# Altium project ASM001-design.PrjPcb (part 1 of 2)
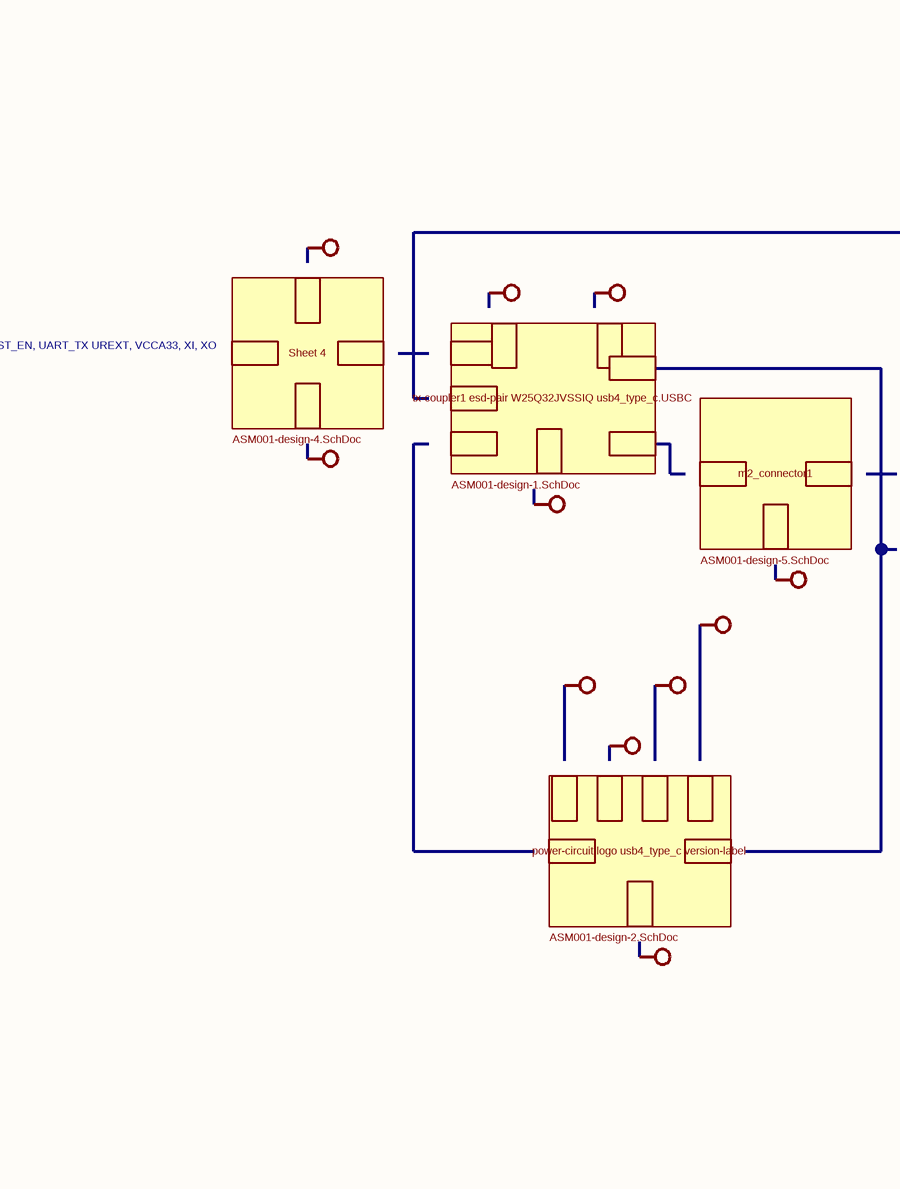
[diagram p0: jitx-top.SchDoc, centre column 2 of 4]
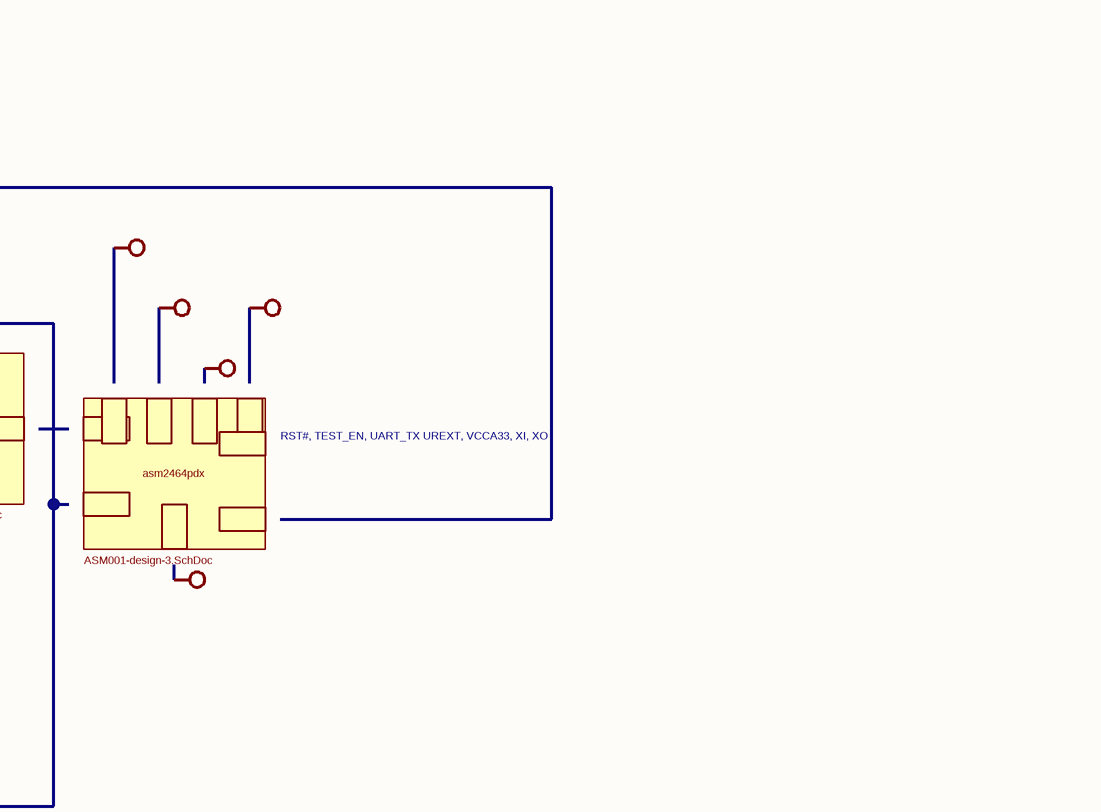
[diagram p1: jitx-top.SchDoc, centre column 3 of 4]
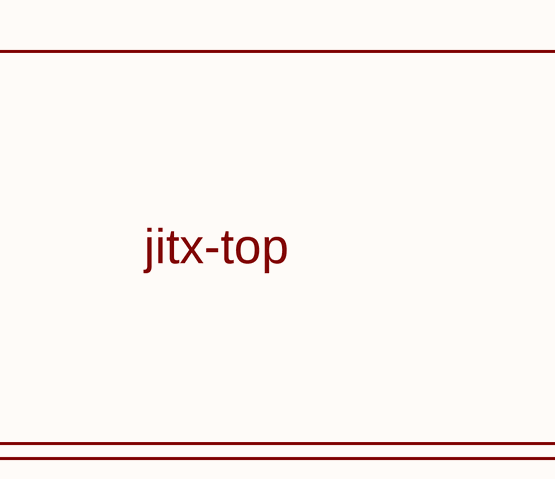
[diagram p2: jitx-top.SchDoc, bottom column 4 of 4]
JITx_Version: 1.0.52.0; JITx_User: John Simons; JITx_Machine: JOHN-WIN11; JITx_Date: 2/7/2025 9:14 PM
6 sheets, 65 parts. Net scope: flat (ports and power ports of the same name join across sheets).
Board file: ASM001-design.PcbDoc
Sheets:
  jitx-top.SchDoc
    tx-coupler1
esd-pair
W25Q32JVSSIQ
usb4_type_c.USBC = ASM001-design-1.SchDoc
    power-circuit
logo
usb4_type_c
version-label = ASM001-design-2.SchDoc
    asm2464pdx = ASM001-design-3.SchDoc
    Sheet 4 = ASM001-design-4.SchDoc
    m2_connector1 = ASM001-design-5.SchDoc

## Sheet jitx-top.SchDoc
size 558 x 431 mm

### Sub-sheets
asm2464pdx = ASM001-design-3.SchDoc: , , , , , , , , 
m2_connector1 = ASM001-design-5.SchDoc: , , 
power-circuit
logo
usb4_type_c
version-label = ASM001-design-2.SchDoc: , , , , , , 
Sheet 4 = ASM001-design-4.SchDoc: , , , 
tx-coupler1
esd-pair
W25Q32JVSSIQ
usb4_type_c.USBC = ASM001-design-1.SchDoc: , , , , , , , 

### Notes on the sheet
- jitx-top
- Labels drawn without touching a wire or pin: RST#, TEST_EN, UART_TX
UREXT, VCCA33, XI, XO

## Sheet ASM001-design-1.SchDoc
size 558 x 431 mm
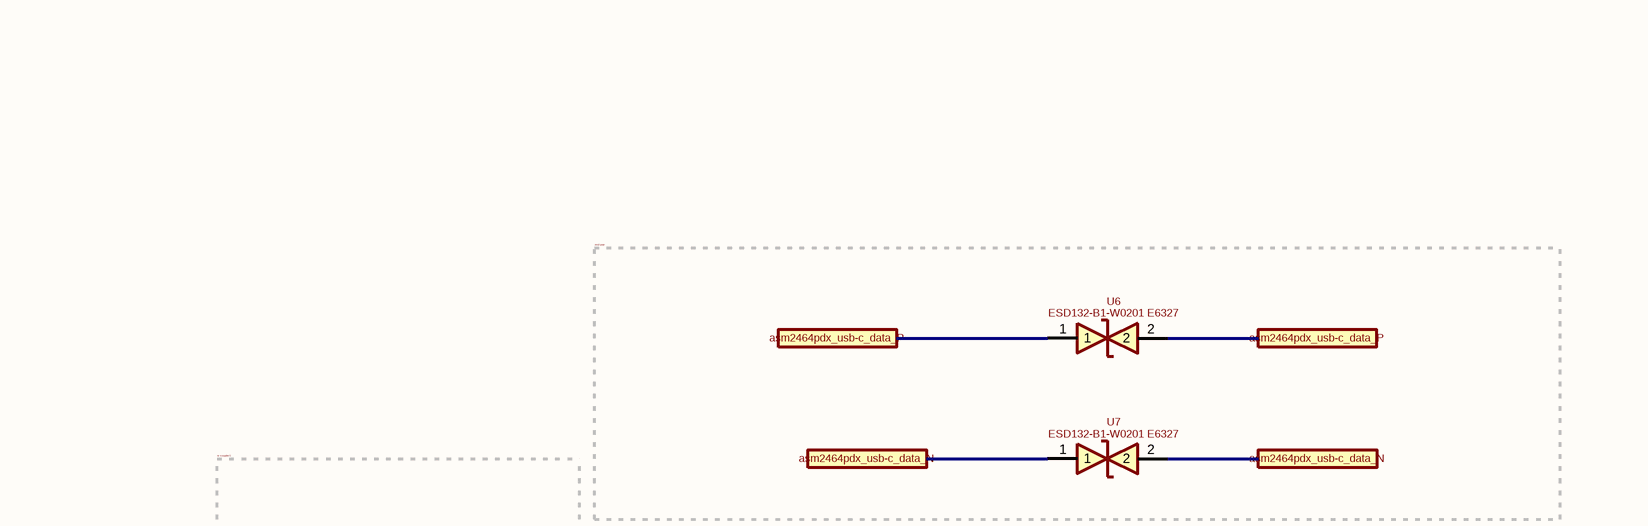
[diagram p3: ASM001-design-1.SchDoc, top column 2 of 4]
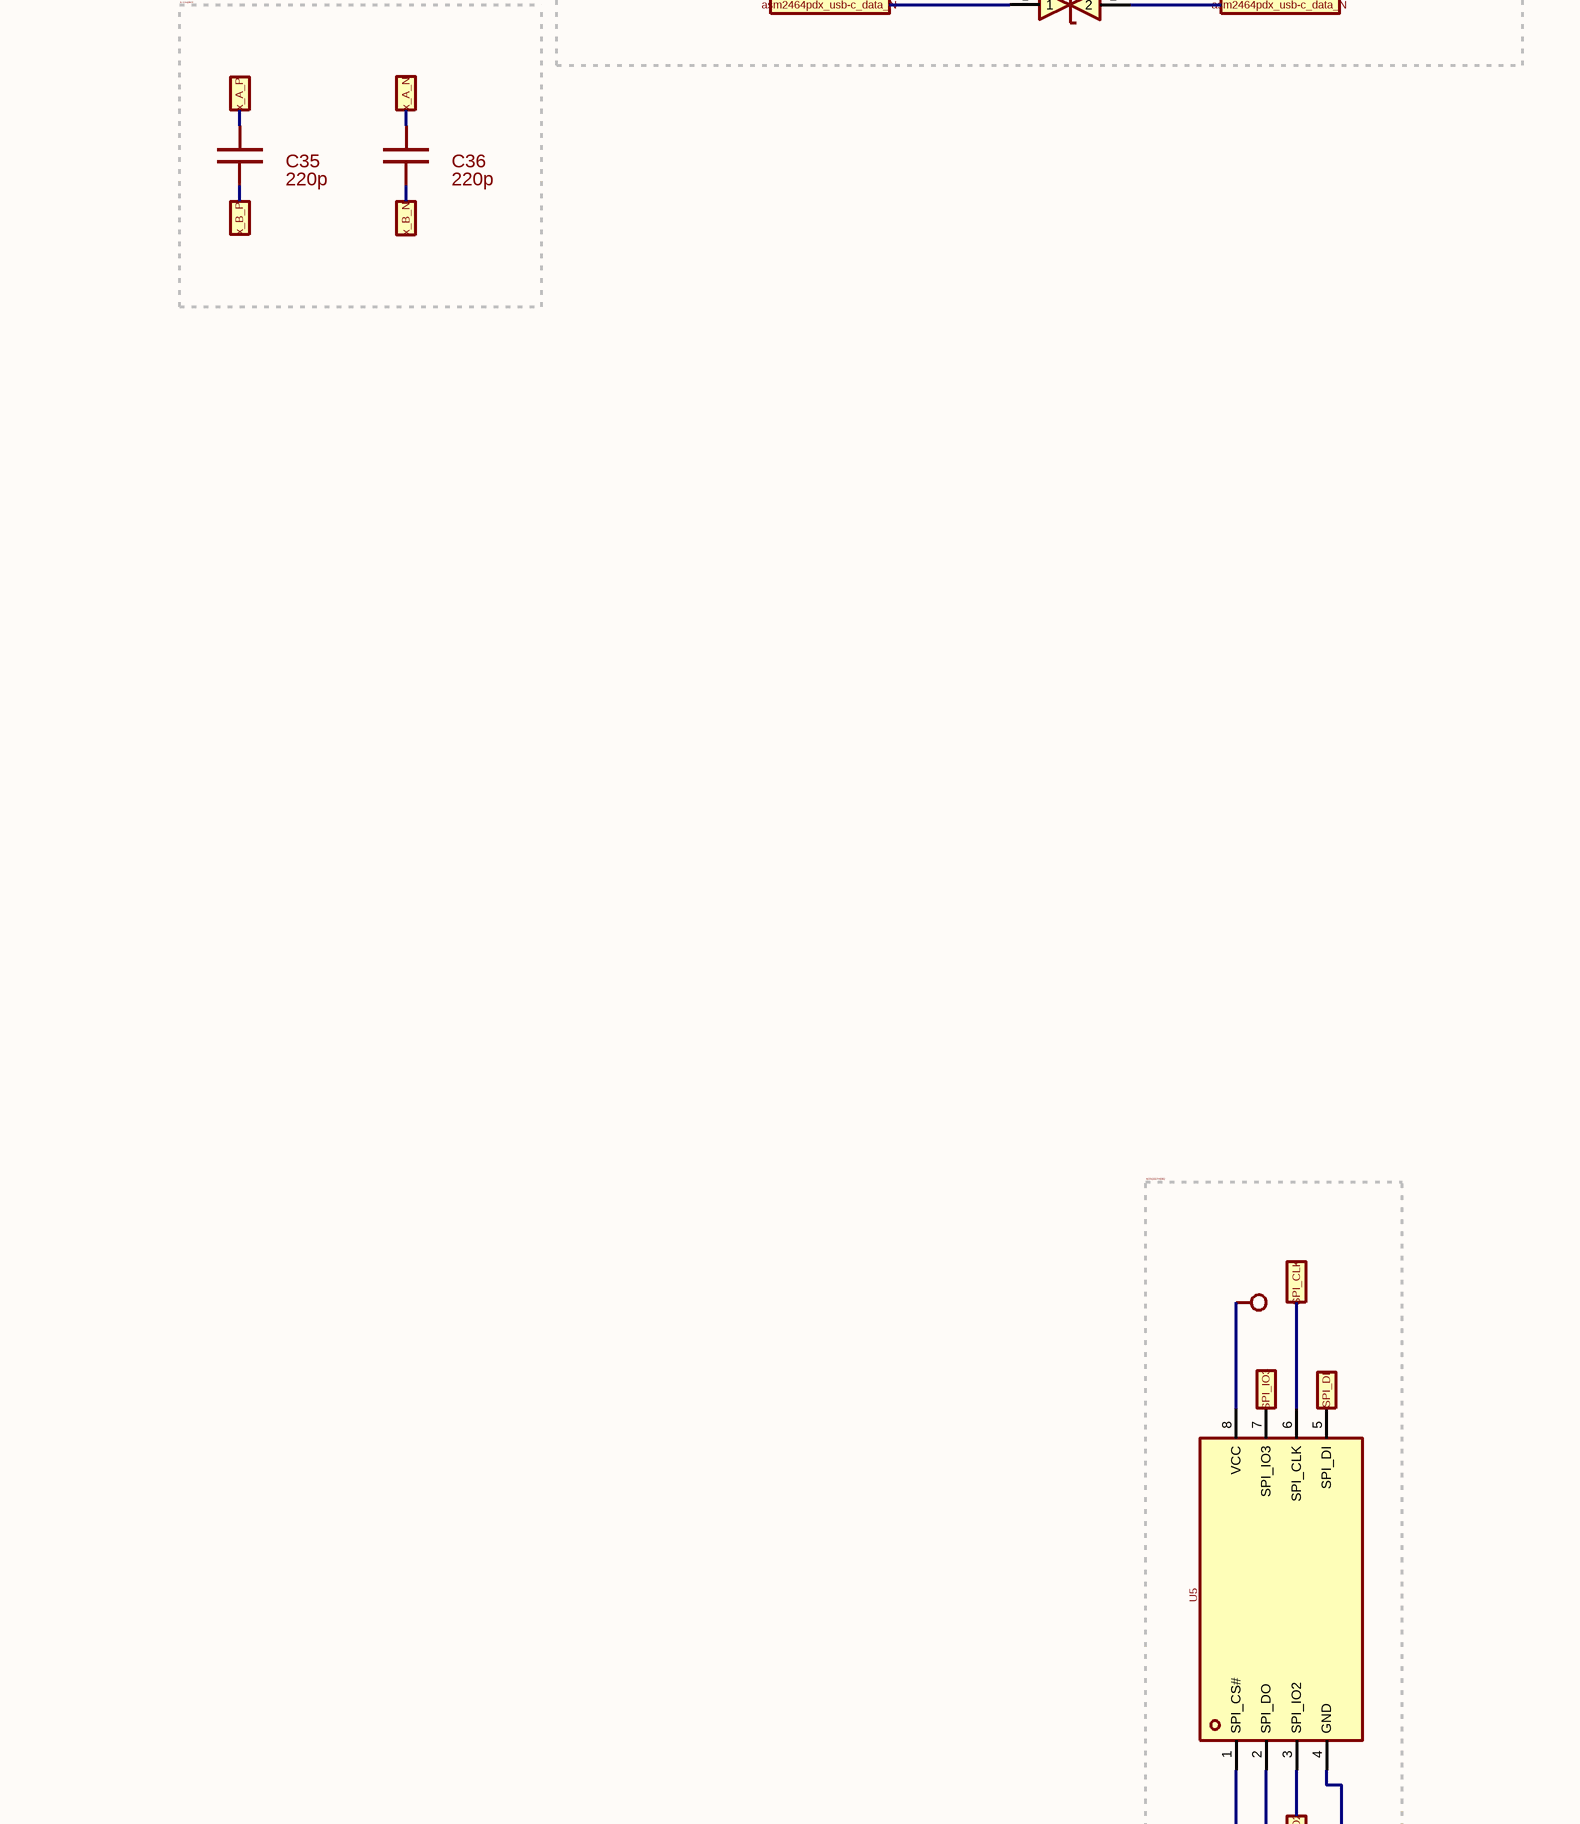
[diagram p4: ASM001-design-1.SchDoc, centre column 2 of 4]
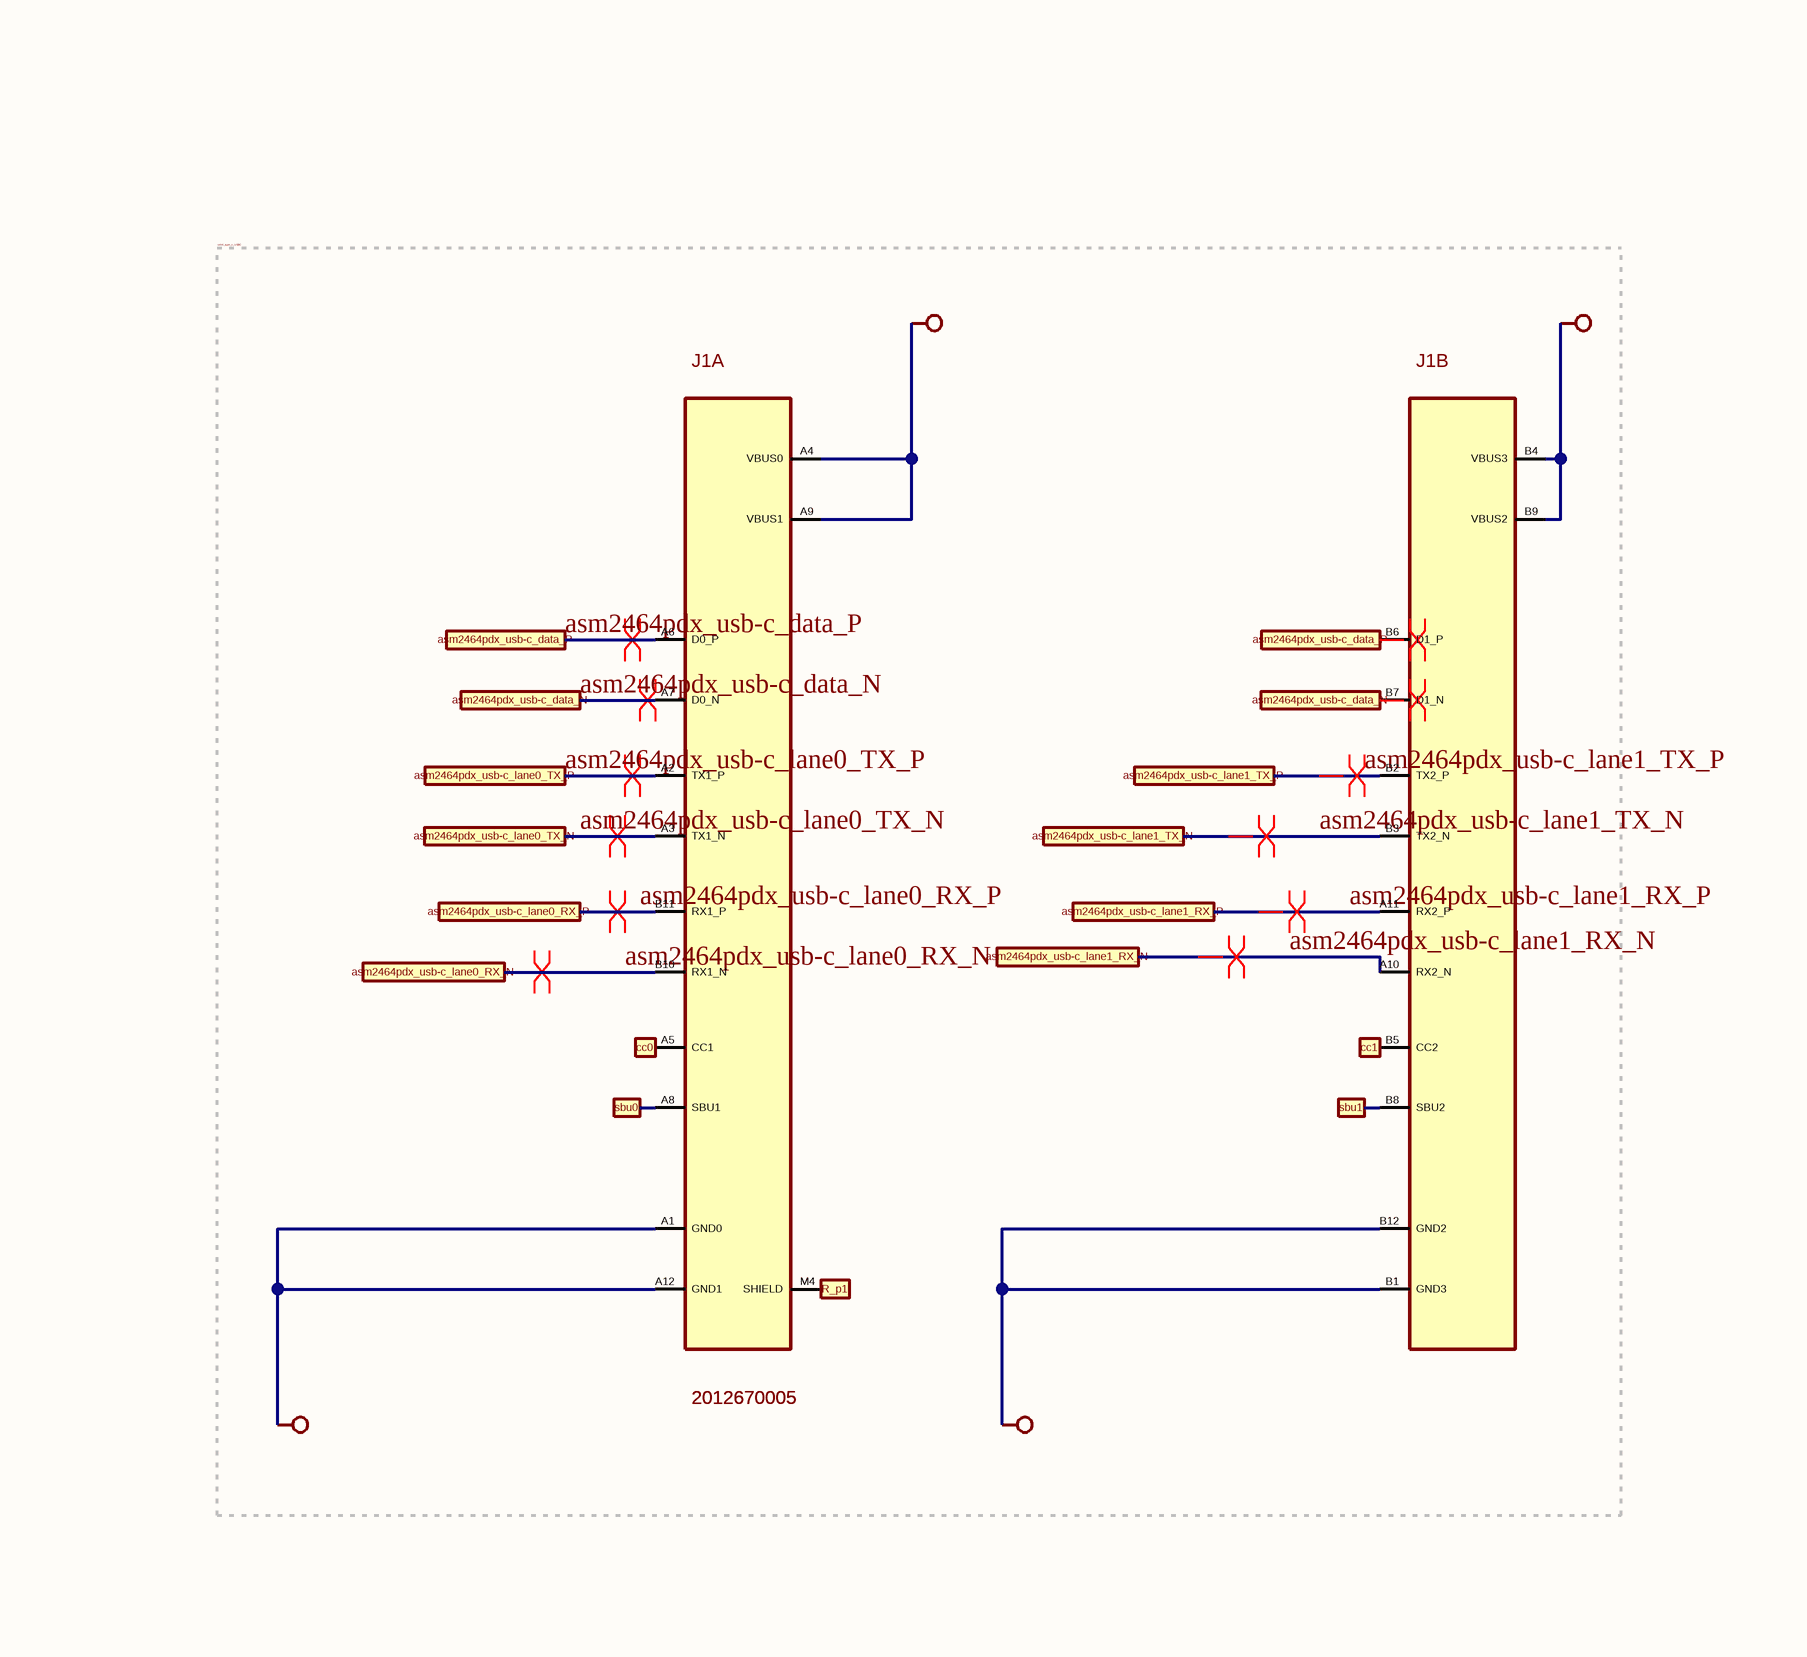
[diagram p5: ASM001-design-1.SchDoc, centre column 3 of 4]
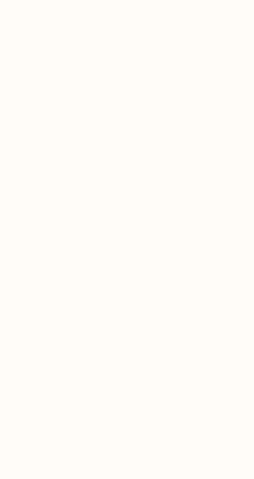
[diagram p6: ASM001-design-1.SchDoc, centre column 4 of 4]
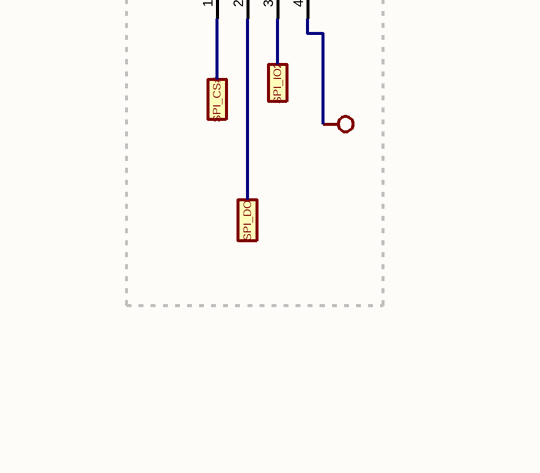
[diagram p7: ASM001-design-1.SchDoc, bottom column 2 of 4]
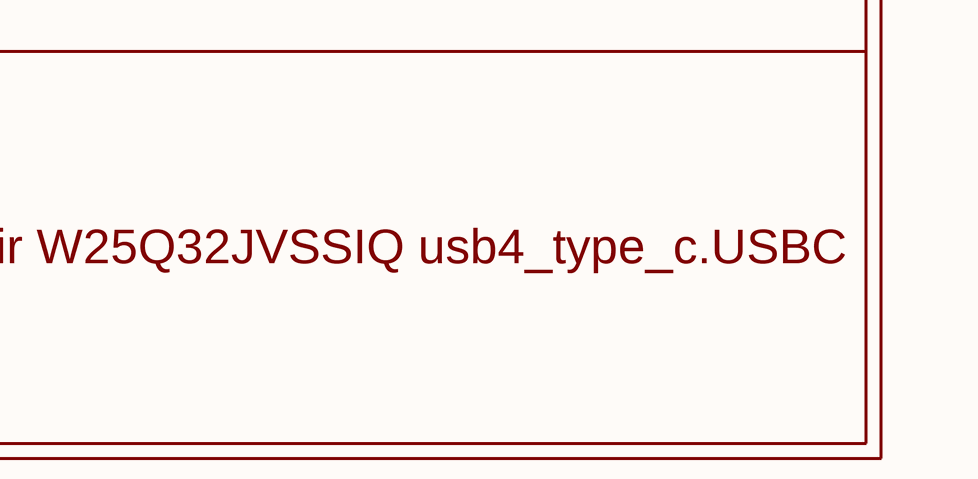
[diagram p8: ASM001-design-1.SchDoc, bottom column 4 of 4]

### Parts
C35  value 220p  [SMT_0201$1]  (hidden comment: block_cap)
C36  value 220p  [SMT_0201$1]  (hidden comment: block_cap)
J1  value 2012670005  value 2012670005  [USB_TYPE_C_CONNECTOR]  (hidden comment: conn_component)  (parts A,B of 2)
U5  value W25Q32JVSSIQ  [LP$1]  (hidden comment: C82344)
U6  value ESD132-B1-W0201 E6327  [LP$3]  (hidden comment: C535164)
U7  value ESD132-B1-W0201 E6327  [LP$3]  (hidden comment: C535164)

### Blocks framed on the sheet
esd-pair: U6 U7
tx-coupler1: C35 C36
usb4_type_c_USBC: J1
W25Q32JVSSIQ: U5

### Ports
asm2464pdx_usb-c_data_N, asm2464pdx_usb-c_data_P, asm2464pdx_usb-c_lane0_RX_N, asm2464pdx_usb-c_lane0_RX_P, asm2464pdx_usb-c_lane0_TX_N, asm2464pdx_usb-c_lane0_TX_P, asm2464pdx_usb-c_lane1_RX_N, asm2464pdx_usb-c_lane1_RX_P, asm2464pdx_usb-c_lane1_TX_N, asm2464pdx_usb-c_lane1_TX_P, cc0, cc1, R_p1, sbu0, sbu1, SPI_CLK, SPI_CS#, SPI_DI, SPI_DO, SPI_IO2, SPI_IO3, x_A_N, x_A_P, x_B_N, x_B_P

### Nets
NetC1_2: J1.A1(GND0) J1.A4(VBUS0) J1.A9(VBUS1) J1.A12(GND1) J1.B1(GND3) J1.B4(VBUS3) J1.B9(VBUS2) J1.B12(GND2) U5.4(GND) U5.8(VCC)
asm2464pdx_usb-c_data_N: J1.A7(D0_N) J1.B7(D1_N) U7.1 U7.2 ; port asm2464pdx_usb-c_data_N
asm2464pdx_usb-c_data_P: J1.A6(D0_P) J1.B6(D1_P) U6.1 U6.2 ; port asm2464pdx_usb-c_data_P
asm2464pdx_usb-c_lane0_RX_N: J1.B10(RX1_N) ; port asm2464pdx_usb-c_lane0_RX_N
asm2464pdx_usb-c_lane0_RX_P: J1.B11(RX1_P) ; port asm2464pdx_usb-c_lane0_RX_P
asm2464pdx_usb-c_lane0_TX_N: J1.A3(TX1_N) ; port asm2464pdx_usb-c_lane0_TX_N
asm2464pdx_usb-c_lane0_TX_P: J1.A2(TX1_P) ; port asm2464pdx_usb-c_lane0_TX_P
asm2464pdx_usb-c_lane1_RX_N: J1.A10(RX2_N) ; port asm2464pdx_usb-c_lane1_RX_N
asm2464pdx_usb-c_lane1_RX_P: J1.A11(RX2_P) ; port asm2464pdx_usb-c_lane1_RX_P
asm2464pdx_usb-c_lane1_TX_N: J1.B3(TX2_N) ; port asm2464pdx_usb-c_lane1_TX_N  [project net asm2464pdx_usb-c_lane1_RX_N]
asm2464pdx_usb-c_lane1_TX_P: J1.B2(TX2_P) ; port asm2464pdx_usb-c_lane1_TX_P  [project net asm2464pdx_usb-c_lane1_RX_P]
X_B_N: C36.2 ; port x_B_N
X_B_P: C35.2 ; port x_B_P
NetC1_1: J1.M4(SHIELD) ; port R_p1
NetC2_1: J1.A5(CC1) ; port cc0
NetC6_1: J1.B5(CC2) ; port cc1
NetC35_1: C35.1 ; port x_A_P
NetC36_1: C36.1 ; port x_A_N
NetJ1_A8: J1.A8(SBU1) ; port sbu0
NetJ1_B8: J1.B8(SBU2) ; port sbu1
NetR15_1: U5.3(SPI_IO2) ; port SPI_IO2
NetR16_1: U5.7(SPI_IO3) ; port SPI_IO3
NetU4_A2: U5.1(SPI_CS#) ; port SPI_CS#
NetU4_A3: U5.2(SPI_DO) ; port SPI_DO
NetU4_A4: U5.5(SPI_DI) ; port SPI_DI
NetU4_A5: U5.6(SPI_CLK) ; port SPI_CLK

### Layout directives
differential pair: asm2464pdx_usb-c_data_N, asm2464pdx_usb-c_data_P
differential pair; rule Signal Stimulus [Kind - Single Pulse    Level - High    Start Time = 0.000    Stop Time = 25.00p    Period Time = 50.00p]: asm2464pdx_usb-c_lane0_RX_N, asm2464pdx_usb-c_lane0_RX_P, asm2464pdx_usb-c_lane0_TX_N, asm2464pdx_usb-c_lane0_TX_P, asm2464pdx_usb-c_lane1_RX_N, asm2464pdx_usb-c_lane1_RX_P
differential pair; rule Signal Stimulus [Kind - Single Pulse    Level - High    Start Time = 0.000    Stop Time = 2.000    Period Time = 50.00p]: asm2464pdx_usb-c_lane1_RX_N

### Notes on the sheet
- tx-coupler1
  esd-pair
  W25Q32JVSSIQ
  usb4_type_c.USBC

### Library data of the parts
C35 C36 = block_cap: MPN: 02013A1R5BAT2A; Manufacturer: KYOCERA AVX; REFERENCE: false; Tolerance: 0.2%; Maximum Voltage: 6.3V; FOOTPRINT: ASM001-design:SMT_0201$1; Capacitance: 220p; Datasheet: https://datasheets.avx.com/C0GNP0-Dielectric.pdf
J1 = conn_component: pin to pad: M4>M4+M3+M2+M1; Manufacturer: Molex; REFERENCE: false; rated-temperature: Toleranced(-40.0 <= 32.5 <= 105.0); FOOTPRINT: ASM001-design:USB_TYPE_C_CONNECTOR; MPN: 2012670005; Datasheet: https://www.molex.com/content/dam/molex/molex-dot-com/products/automated/en-us/salesdrawingpdf/201/201267/2012670005_sd.pdf
U5 = C82344: manufacturer_aliases: ["Winbond Elec"]; mpn_aliases: ["W25Q32JVSSIQ"]; Manufacturer: Winbond; REFERENCE: false; cofactr_id: XX0QC6Y2U3XH; reference_prefix: U; x: 5.43; trust: low; y: 9.413; area: 51.113; FOOTPRINT: ASM001-design:LP$1; case: SOIC-8-208mil; mounting: through-hole; category: ic; MPN: W25Q32JVSSIQ; Datasheet: https://www.lcsc.com/datasheet/lcsc_datasheet_1811101814_Winbond-Elec-W25Q32JVSSIQ_C82344.pdf
U6 U7 = C535164: manufacturer_aliases: ["Infineon Technologies"]; mpn_aliases: ["ESD132-B1-W0201 E6327"]; Manufacturer: Infineon; REFERENCE: false; cofactr_id: XXRARWCT0RJE; reference_prefix: U; x: 1.102; trust: low; y: 0.762; area: 0.84; FOOTPRINT: ASM001-design:LP$3; case: WLL-2-3; category: ic; MPN: ESD132-B1-W0201 E6327; Datasheet: https://www.lcsc.com/datasheet/lcsc_datasheet_2005291706_Infineon-Technologies-ESD132-B1-W0201-E6327_C535164.pdf

## Sheet ASM001-design-2.SchDoc
size 558 x 431 mm
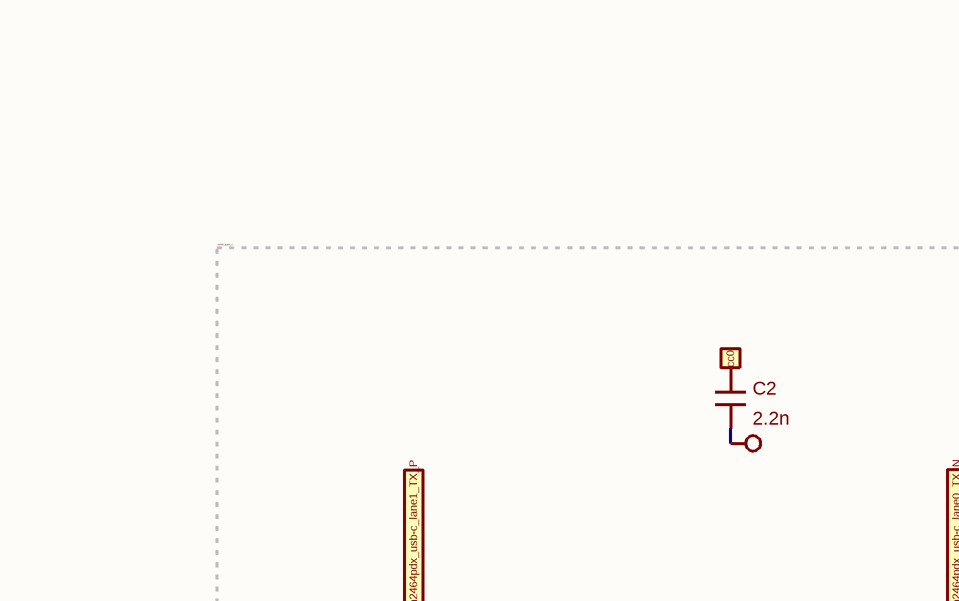
[diagram p9: ASM001-design-2.SchDoc, top column 1 of 4]
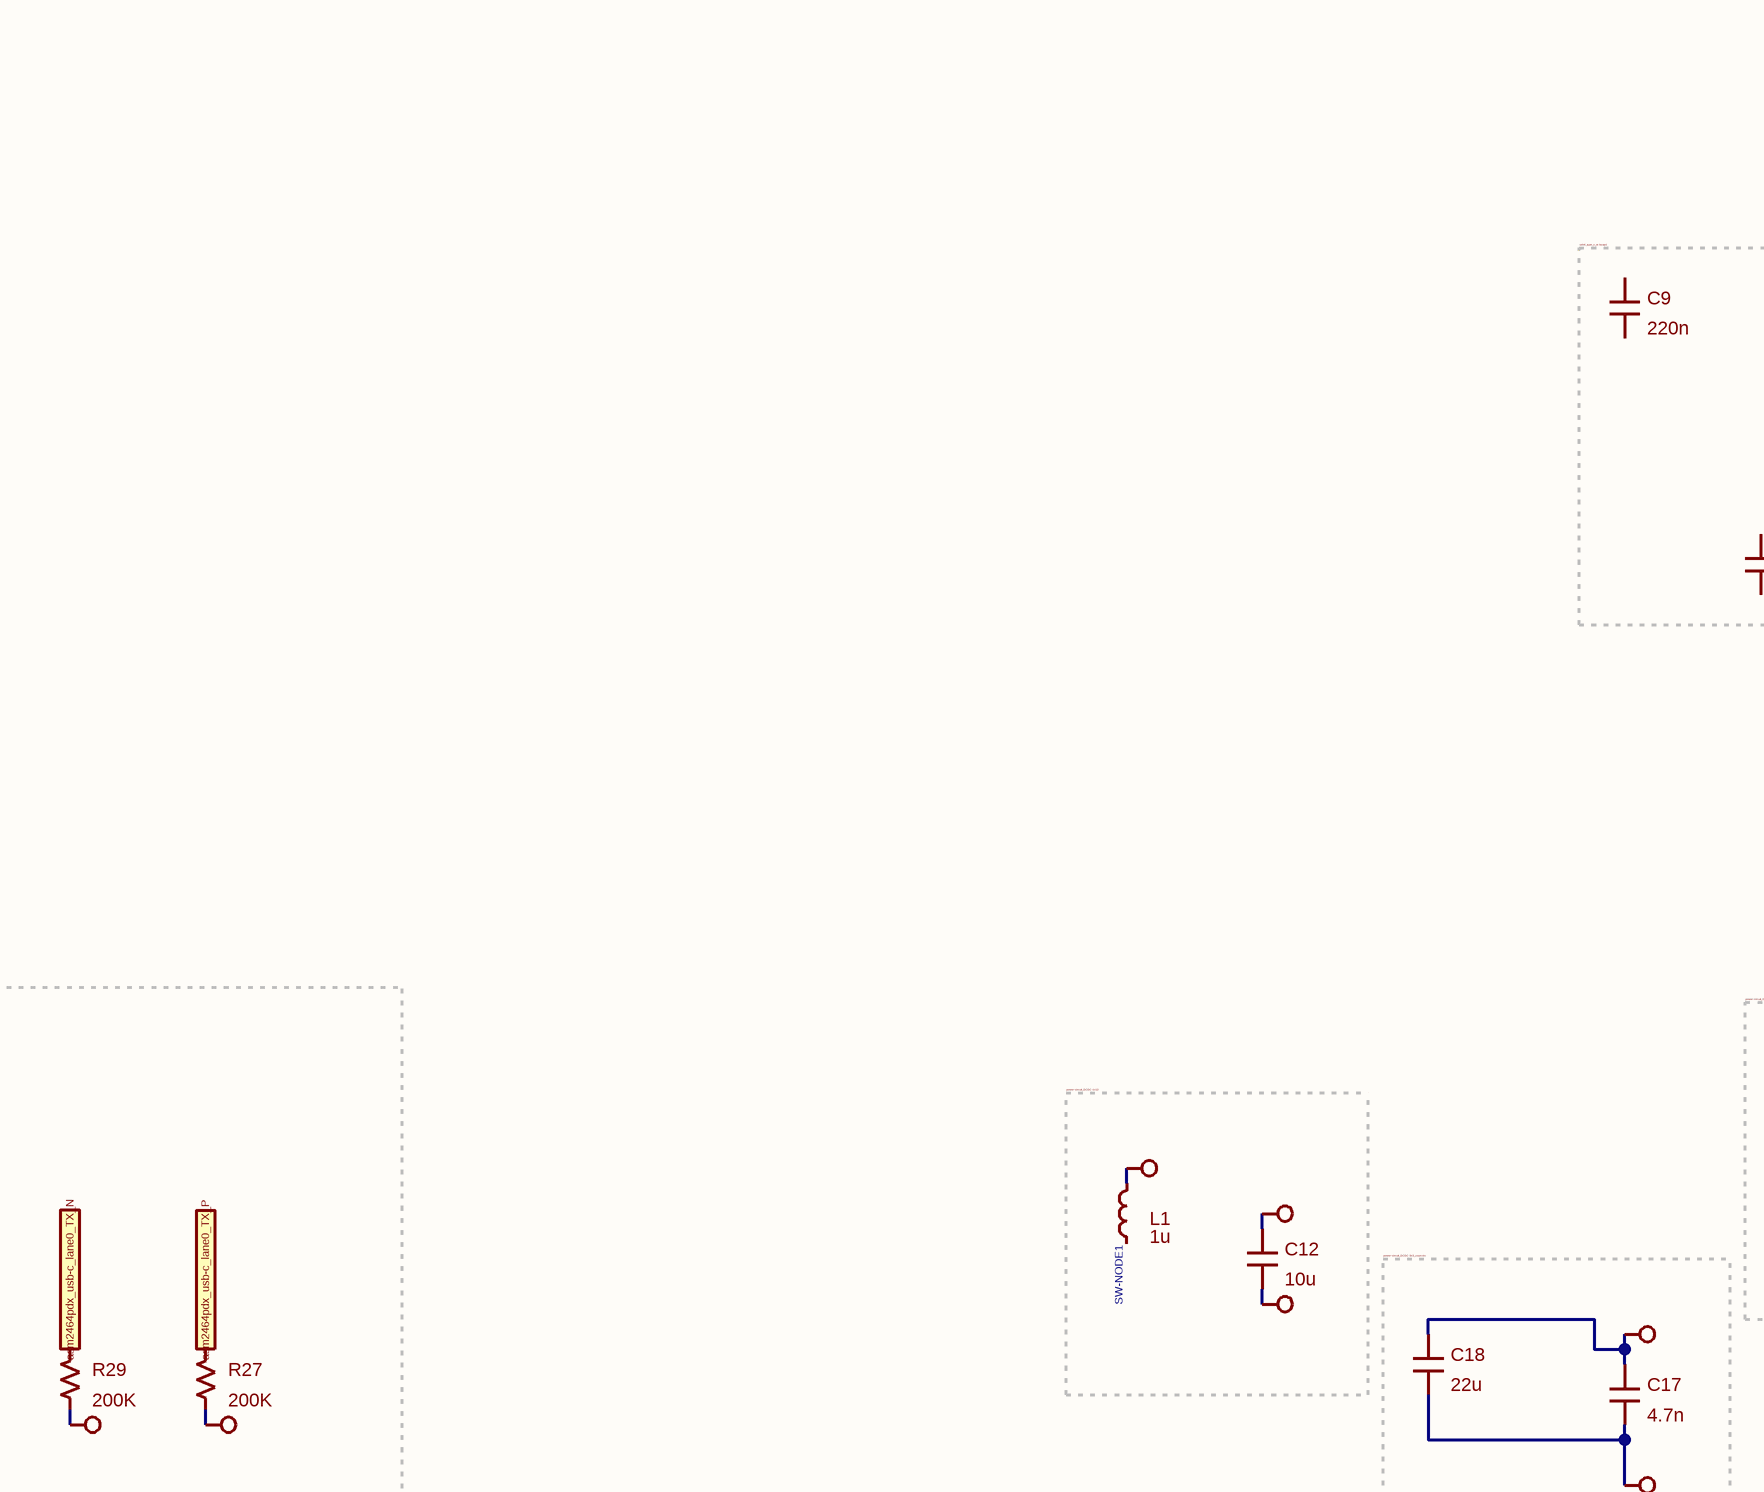
[diagram p10: ASM001-design-2.SchDoc, top column 2 of 4]
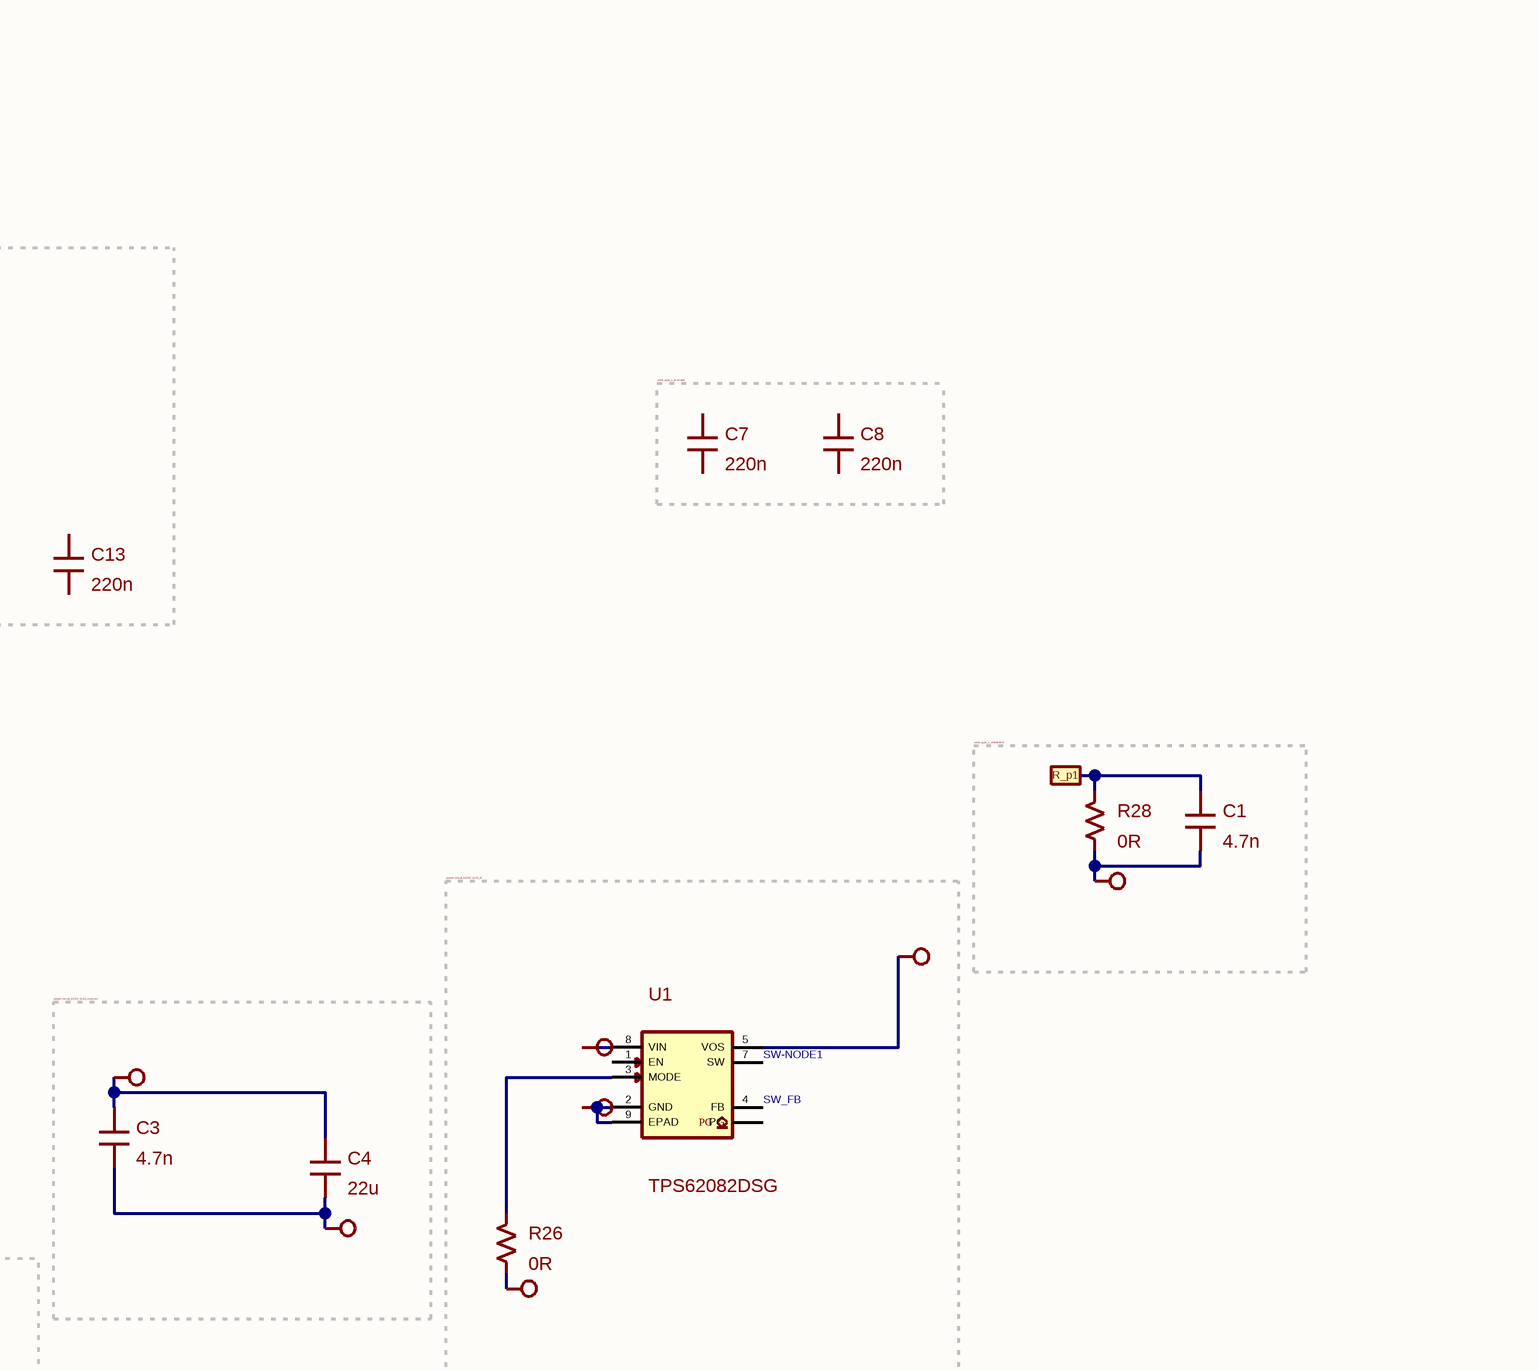
[diagram p11: ASM001-design-2.SchDoc, top column 3 of 4]
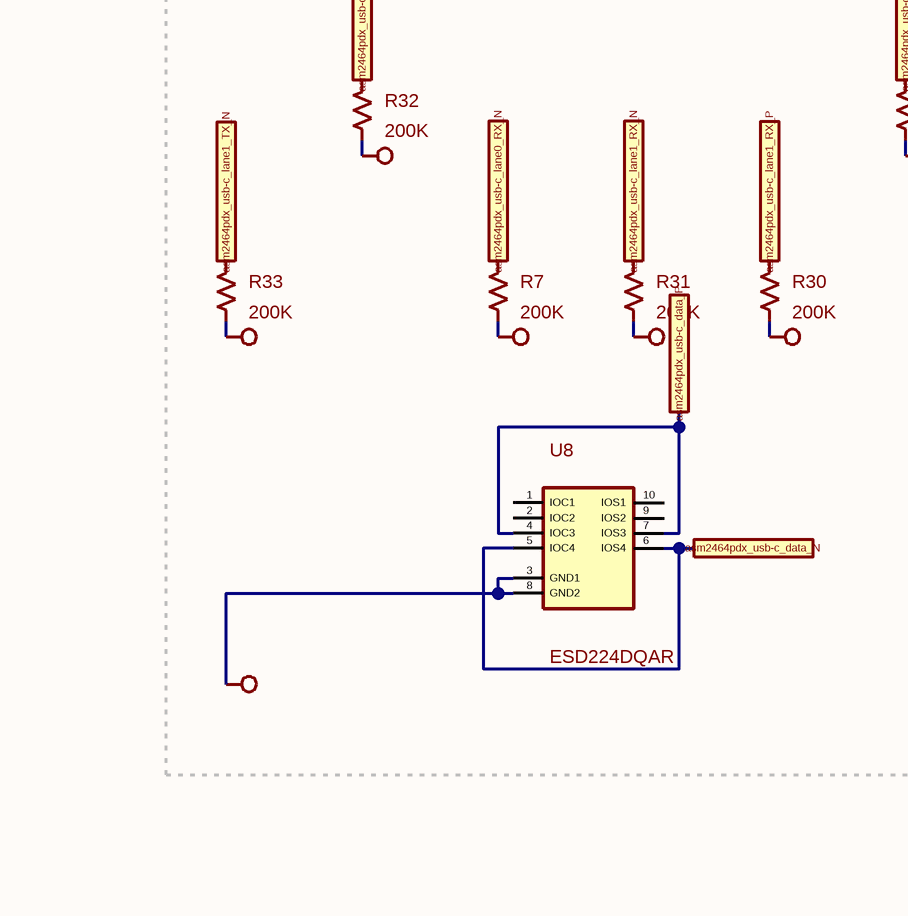
[diagram p12: ASM001-design-2.SchDoc, centre column 1 of 4]
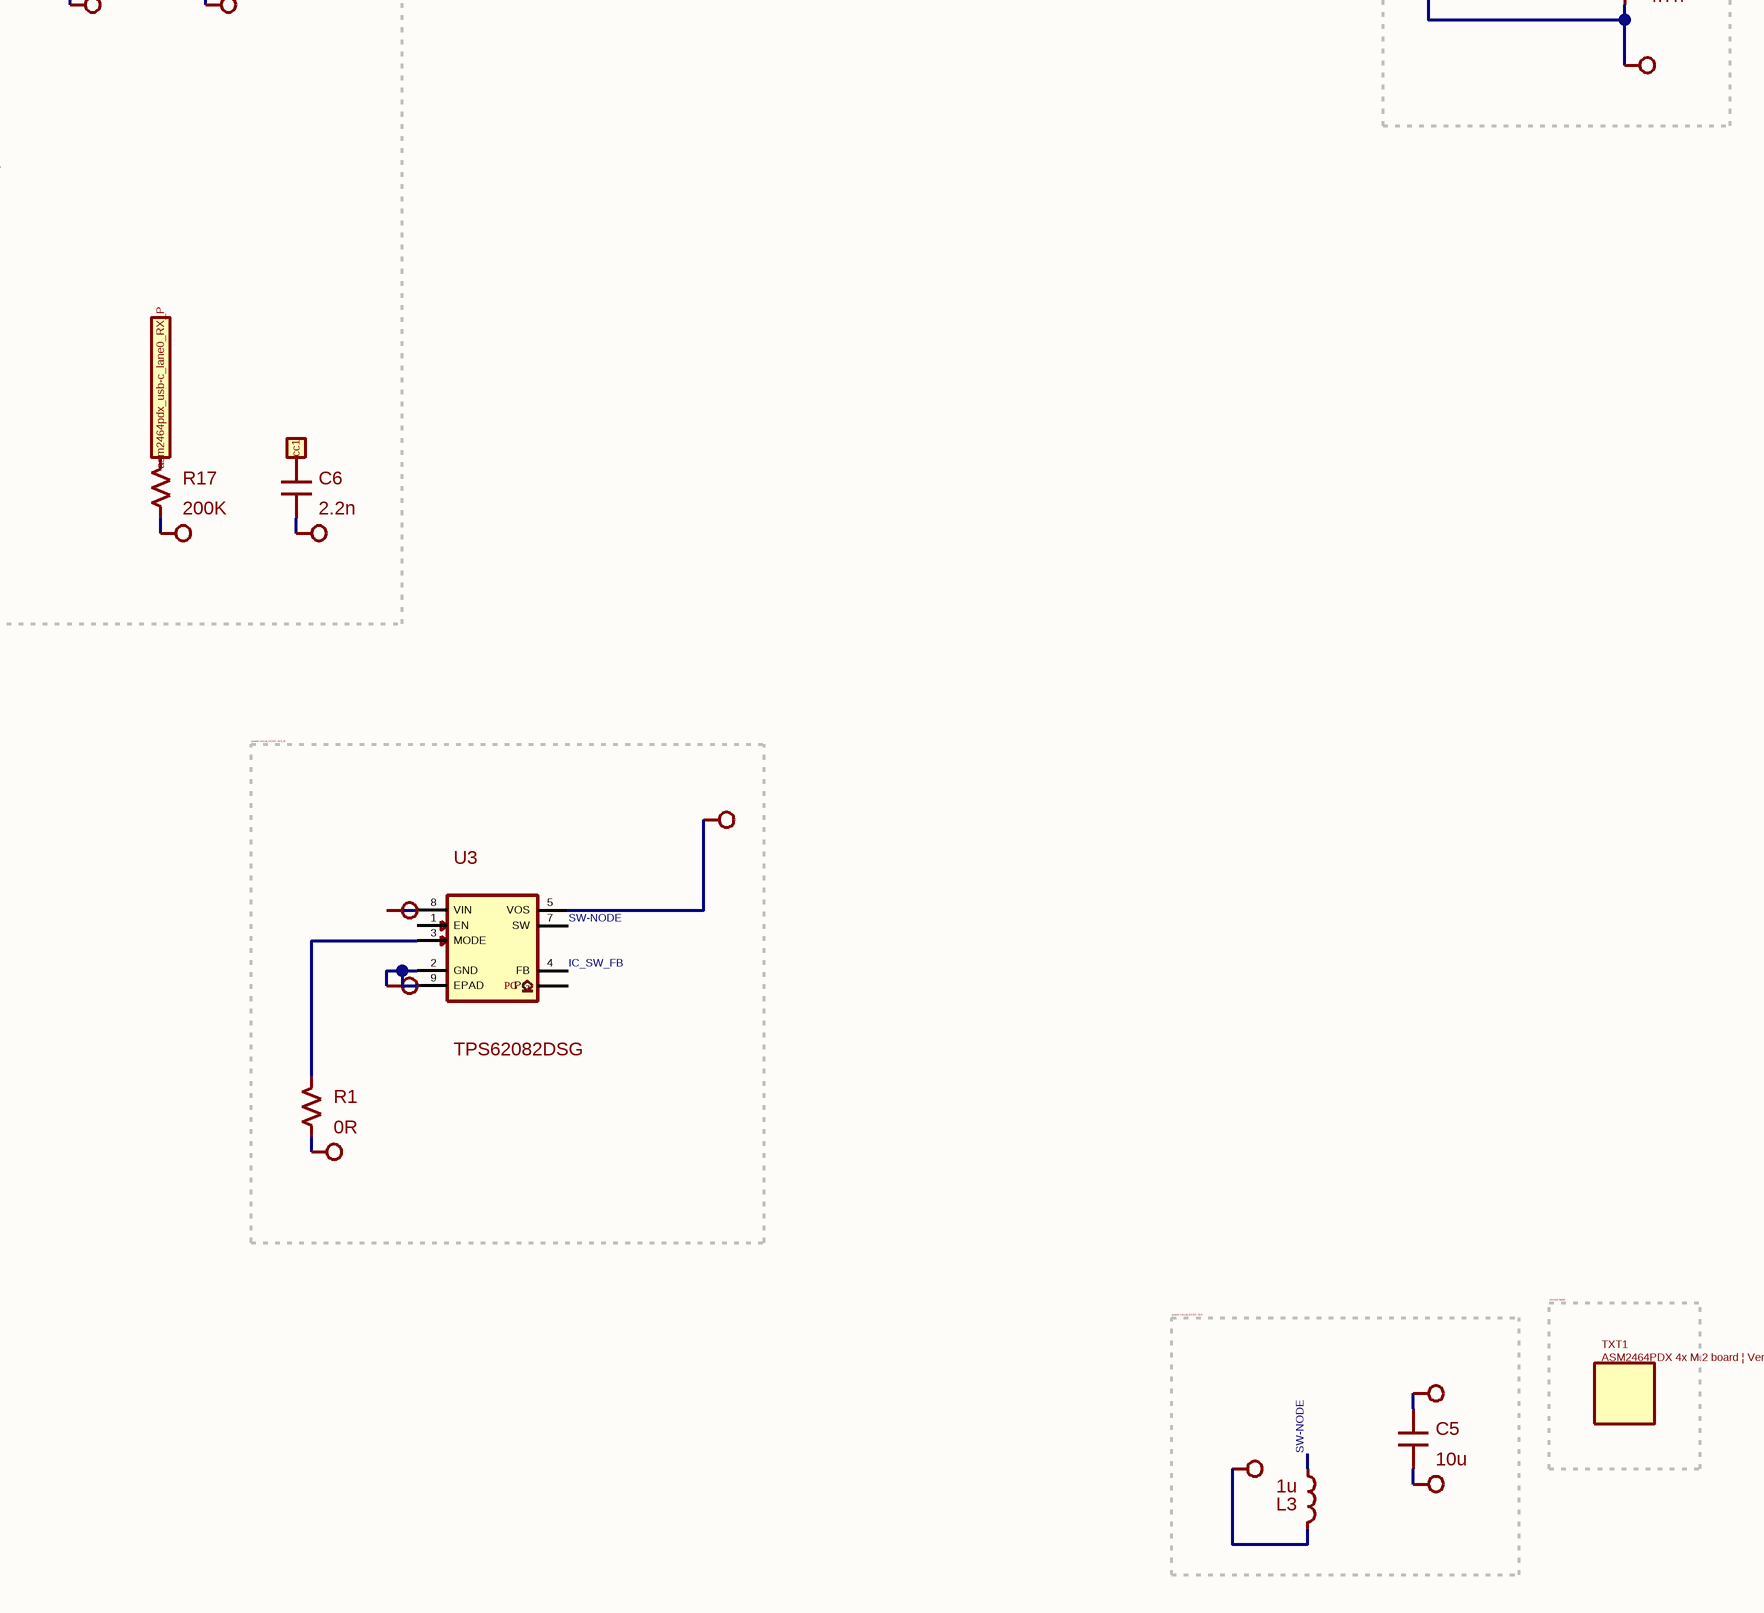
[diagram p13: ASM001-design-2.SchDoc, centre column 2 of 4]
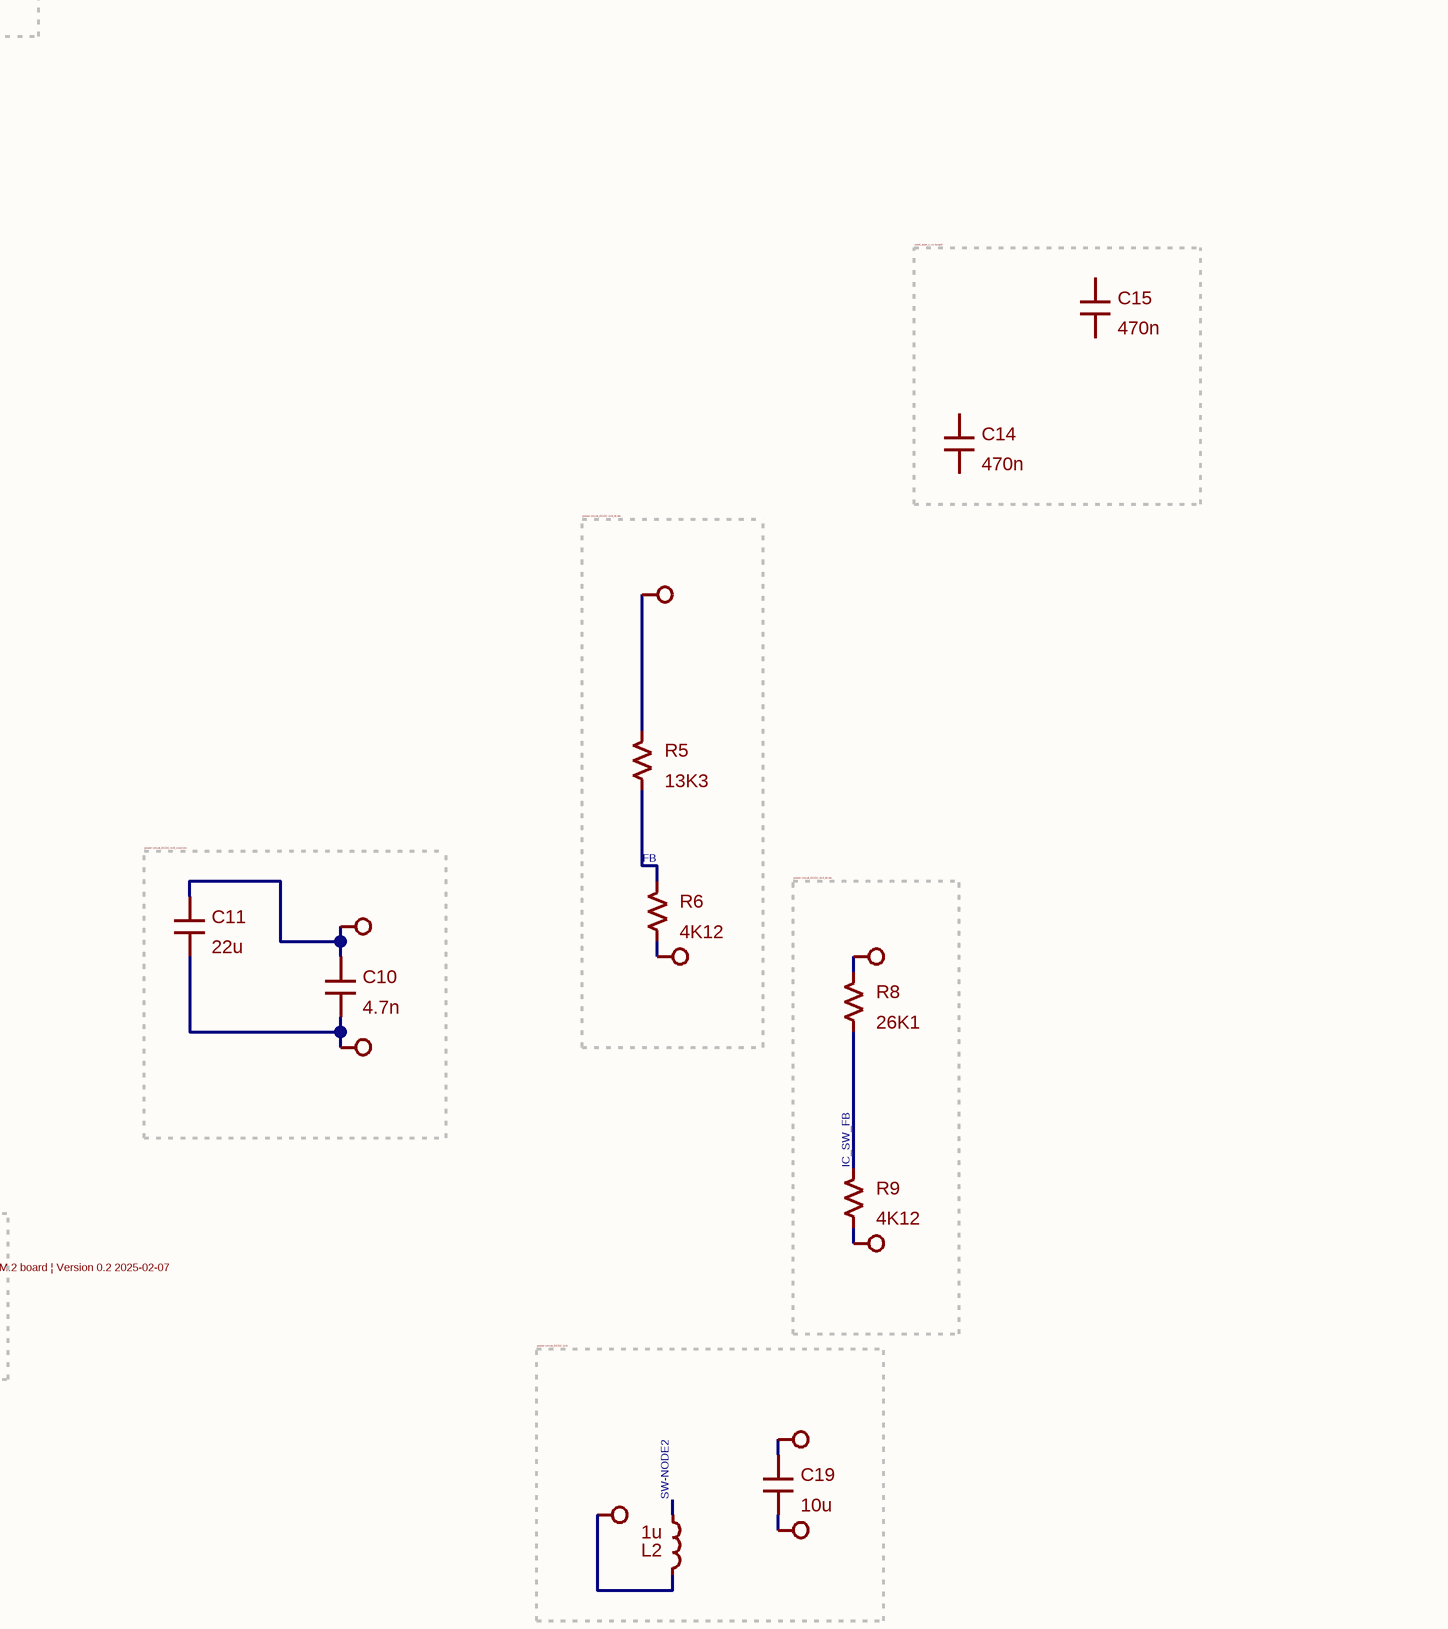
[diagram p14: ASM001-design-2.SchDoc, centre column 3 of 4]
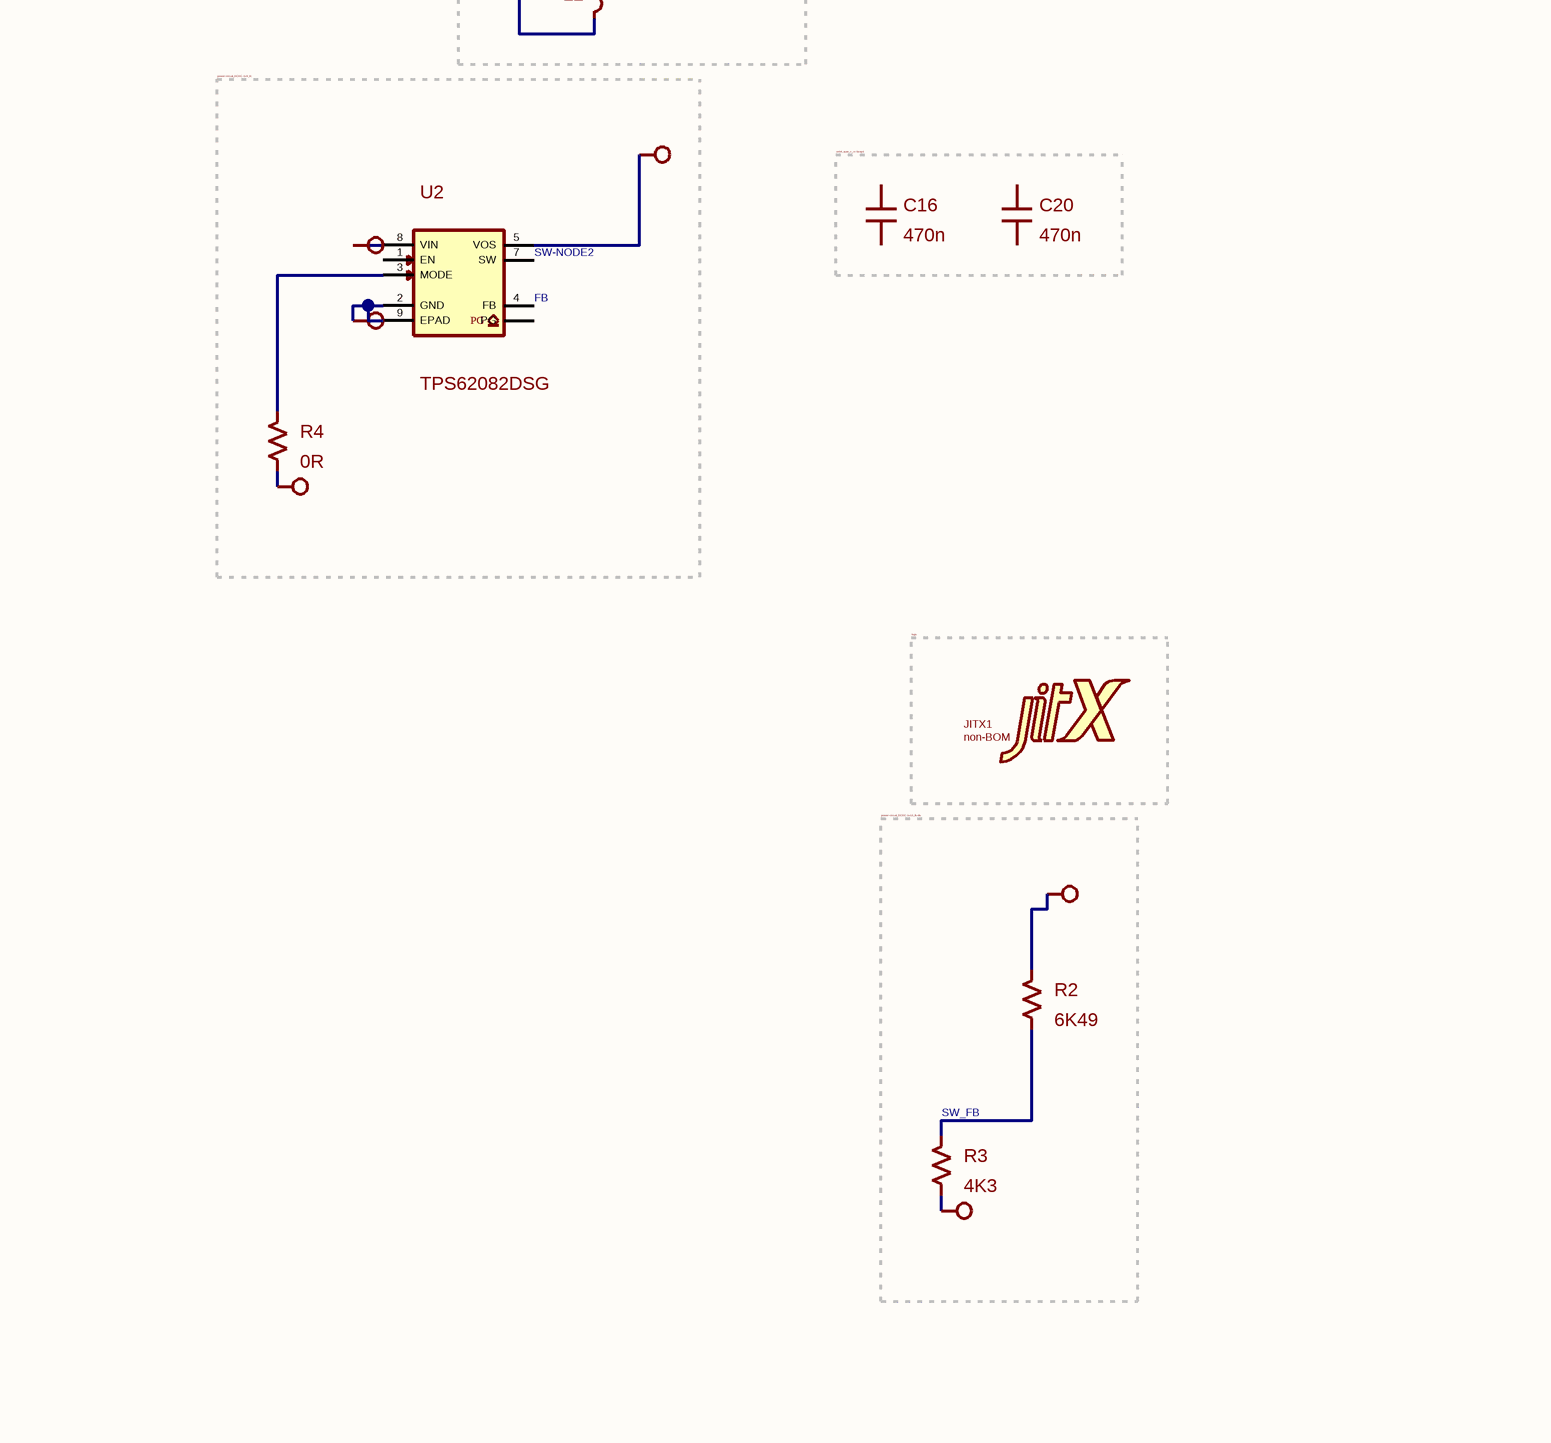
[diagram p15: ASM001-design-2.SchDoc, bottom column 3 of 4]
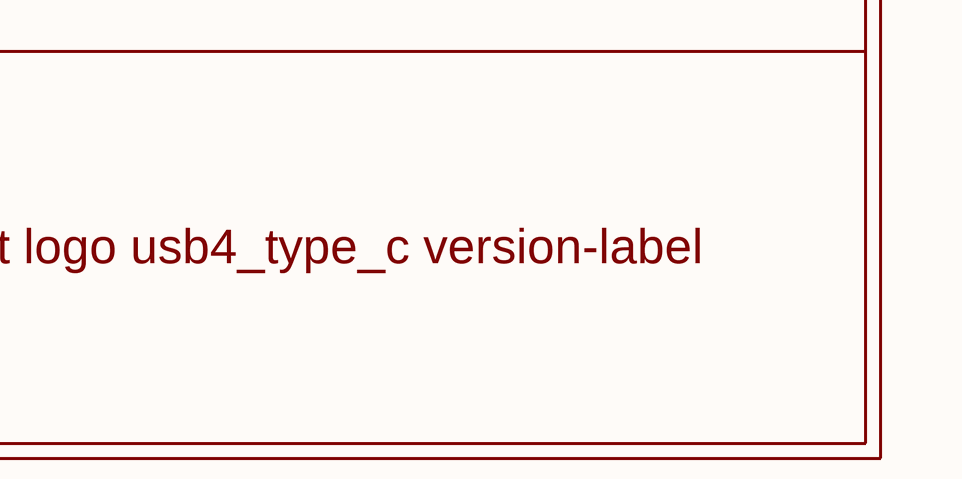
[diagram p16: ASM001-design-2.SchDoc, bottom column 4 of 4]

### Parts
C1  value 4.7n  [Pkg0402$8]  (hidden comment: C106208$1)
C2  value 2.2n  [Pkg0402$1]  (hidden comment: C338130)
C3  value 4.7n  [Pkg0402$15]  (hidden comment: C106208$2)
C4  value 22u  [Pkg0805]  (hidden comment: C87997$1)
C5  value 10u  [Pkg0603$3]  (hidden comment: C19702$2)
C6  value 2.2n  [Pkg0402$1]  (hidden comment: C338130)
C7  value 220n  [Pkg0201]  (hidden comment: C76931)
C8  value 220n  [Pkg0201]  (hidden comment: C76931)
C9  value 220n  [Pkg0201]  (hidden comment: C76931)
C10  value 4.7n  [Pkg0402$11]  (hidden comment: C106208)
C11  value 22u  [Pkg0805$2]  (hidden comment: C87997)
C12  value 10u  [Pkg0603$2]  (hidden comment: C19702$1)
C13  value 220n  [Pkg0201]  (hidden comment: C76931)
C14  value 470n  [Pkg0201$3]  (hidden comment: C85926)
C15  value 470n  [Pkg0201$3]  (hidden comment: C85926)
C16  value 470n  [Pkg0201$3]  (hidden comment: C85926)
C17  value 4.7n  [Pkg0402$4]  (hidden comment: C106208$3)
C18  value 22u  [Pkg0805$1]  (hidden comment: C87997$2)
C19  value 10u  [Pkg0603$1]  (hidden comment: C19702)
C20  value 470n  [Pkg0201$3]  (hidden comment: C85926)
JITX1  value non-BOM  [JITX_SM_LP]  (hidden comment: JITX)
L1  value 1u  [MOLDED]  (hidden comment: component$3)
L2  value 1u  [MOLDED]  (hidden comment: component$3)
L3  value 1u  [MOLDED]  (hidden comment: component$3)
R1  value 0R  [Pkg0402$16]  (hidden comment: my_resistor$4)
R2  value 6K49  [Pkg0402$14]  (hidden comment: C364360)
R3  value 4K3  [Pkg0402]  (hidden comment: my_resistor$9)
R4  value 0R  [Pkg0402$6]  (hidden comment: my_resistor$1)
R5  value 13K3  [Pkg0402$9]  (hidden comment: C334647)
R6  value 4K12  [Pkg0402$13]  (hidden comment: C327340)
R7  value 200K  [Pkg0201$1]  (hidden comment: my_resistor)
R8  value 26K1  [Pkg0603]  (hidden comment: my_resistor$3)
R9  value 4K12  [Pkg0402$7]  (hidden comment: my_resistor$6)
R17  value 200K  [Pkg0201$1]  (hidden comment: my_resistor)
R26  value 0R  [Pkg0402$12]  (hidden comment: my_resistor$5)
R27  value 200K  [Pkg0201$1]  (hidden comment: my_resistor)
R28  value 0R  [Pkg0402$3]  (hidden comment: my_resistor$2)
R29  value 200K  [Pkg0201$1]  (hidden comment: my_resistor)
R30  value 200K  [Pkg0201$1]  (hidden comment: my_resistor)
R31  value 200K  [Pkg0201$1]  (hidden comment: my_resistor)
R32  value 200K  [Pkg0201$1]  (hidden comment: my_resistor)
R33  value 200K  [Pkg0201$1]  (hidden comment: my_resistor)
TXT1  value ASM2464PDX 4x M.2 board | Version 0.2 2025-02-07  [TEXT_LP]  (hidden comment: ASM2464PDX_4x_M_2_board___Version_0_2_2025_02_07)
U1  value TPS62082DSG  [SON50P200X200_9N]  (hidden comment: component$1)
U2  value TPS62082DSG  [SON50P200X200_9N]  (hidden comment: component$1)
U3  value TPS62082DSG  [SON50P200X200_9N]  (hidden comment: component$1)
U8  value ESD224DQAR  [USON_10]  (hidden comment: device)

### Blocks framed on the sheet
usb4_type_c_tx-bcap1: C9 C13
usb4_type_c_tx-bcap0: C7 C8
usb4_type_c_shield-term: C1 R28
power-circuit_DCDC-1v13_IC: R26 U1
usb4_type_c: C2 C6 R7 R17 R27 R29-R33 U8
power-circuit_DCDC-1v13_cout-circ: C3 C4
power-circuit_DCDC-1v13: C12 L1
power-circuit_DCDC-3v3_cout-circ: C17 C18
usb4_type_c_rx-bcap0: C14 C15
power-circuit_DCDC-1v9_fb-div: R5 R6
power-circuit_DCDC-3v3_IC: R1 U3
power-circuit_DCDC-1v9_cout-circ: C10 C11
power-circuit_DCDC-3v3_fb-div: R8 R9
version-label: TXT1
power-circuit_DCDC-3v3: C5 L3
power-circuit_DCDC-1v9: C19 L2
power-circuit_DCDC-1v9_IC: R4 U2
usb4_type_c_rx-bcap1: C16 C20
logo: JITX1
power-circuit_DCDC-1v13_fb-div: R2 R3

### Ports
asm2464pdx_usb-c_data_N, asm2464pdx_usb-c_data_P, asm2464pdx_usb-c_lane0_RX_N, asm2464pdx_usb-c_lane0_RX_P, asm2464pdx_usb-c_lane0_TX_N, asm2464pdx_usb-c_lane0_TX_P, asm2464pdx_usb-c_lane1_RX_N, asm2464pdx_usb-c_lane1_RX_P, asm2464pdx_usb-c_lane1_TX_N, asm2464pdx_usb-c_lane1_TX_P, cc0, cc1, R_p1

### Nets
NetC1_2: C1.2 C2.2 C3.1 C3.2 C4.1 C4.2 C5.1 C5.2 C6.2 C10.1 C10.2 C11.1 C11.2 C12.1 C12.2 C17.1 C17.2 C18.1 C18.2 C19.1 C19.2 L1.a L2.a L3.a R1.2 R2.1 R3.2 R4.2 R5.1 R6.2 R7.2 R8.1 R9.2 R17.2 R26.2 R27.2 R28.2 R29.2 R30.2 R31.2 R32.2 R33.2 U1.2(GND) U1.5(VOS) U1.8(VIN) U1.9(EPAD) U2.2(GND) U2.5(VOS) U2.8(VIN) U2.9(EPAD) U3.2(GND) U3.5(VOS) U3.8(VIN) U3.9(EPAD) U8.3(GND1) U8.8(GND2)
asm2464pdx_usb-c_data_N: U8.5(IOC4) U8.6(IOS4) ; port asm2464pdx_usb-c_data_N
asm2464pdx_usb-c_data_P: U8.4(IOC3) U8.7(IOS3) ; port asm2464pdx_usb-c_data_P
asm2464pdx_usb-c_lane0_RX_N: R7.1 ; port asm2464pdx_usb-c_lane0_RX_N
asm2464pdx_usb-c_lane0_RX_P: R17.1 ; port asm2464pdx_usb-c_lane0_RX_P
asm2464pdx_usb-c_lane0_TX_N: R29.1 ; port asm2464pdx_usb-c_lane0_TX_N
asm2464pdx_usb-c_lane0_TX_P: R27.1 ; port asm2464pdx_usb-c_lane0_TX_P
asm2464pdx_usb-c_lane1_RX_N: R33.1 ; port asm2464pdx_usb-c_lane1_TX_N
asm2464pdx_usb-c_lane1_RX_N: R31.1 ; port asm2464pdx_usb-c_lane1_RX_N  [a separate net that carries the same name]
asm2464pdx_usb-c_lane1_RX_P: R32.1 ; port asm2464pdx_usb-c_lane1_TX_P
asm2464pdx_usb-c_lane1_RX_P: R30.1 ; port asm2464pdx_usb-c_lane1_RX_P  [a separate net that carries the same name]
FB: R5.2 R6.1 U2.4(FB)
IC_SW_FB: R8.2 R9.1 U3.4(FB)
SW-NODE: L3.c U3.7(SW)
SW-NODE1: L1.c U1.7(SW)
SW-NODE2: L2.c U2.7(SW)
SW_FB: R2.2 R3.1 U1.4(FB)
NetC1_1: C1.1 R28.1 ; port R_p1
NetC2_1: C2.1 ; port cc0
NetC6_1: C6.1 ; port cc1
NetR1_1: R1.1 U3.3(MODE)
NetR4_1: R4.1 U2.3(MODE)
NetR26_1: R26.1 U1.3(MODE)

Not connected (* = marked no-connect by the designer): C7 1 2; C8 1 2; C9 1 2; C13 1 2; C14 1 2; C15 1 2; C16 1 2; C20 1 2; U1 1(EN) 6(PG); U2 1(EN) 6(PG); U3 1(EN) 6(PG); U8 1(IOC1) 2(IOC2) 9(IOS2) 10(IOS1)

### Notes on the sheet
- power-circuit
  logo
  usb4_type_c
  version-label

### Library data of the parts
C1 = C106208$1: manufacturer_aliases: ["YAGEO"]; manufacturer: YAGEO; mpn_aliases: ["CC0402KRX7R9BB472"]; mpn: CC0402KRX7R9BB472; REFERENCE: false; capacitor: true; metadata.applications: General Purpose; metadata.packaging: Tape & Reel (TR); reference_prefix: C; area: 0.5; tolerance: Toleranced(4.23e-009 <= 4.7e-009 <= 5.17e-009); rated-voltage: 50.0; query-properties: ["capacitance" => 4.7e-009 "tolerance" => 0.1 "type" => "ceramic" "temperature-coefficient.code" => ["X7R" "X5R"] "min-rated-voltage" => 6.0 "category" => "capacitor" "case" => ["0402" "0603" "0805" "1210"] "mounting" => "smd" "min-stock" => 1 "_sellers" => ["JLCPCB"]]; trust: low; minimum_quantity: 20; cofactr_id: CC7G7J78HHCN; rated-temperature: Toleranced(-55.0 <= 35.0 <= 125.0); capacitance: 4.7e-009; temperature-coefficent: X7R; y: 1.0; type: ceramic; metadata.description: 50V 4.7nF X7R ±10% 0402  Multilayer Ceramic Capacitors MLCC - SMD/SMT ROHS; Maximum Voltage: 50.0V; FOOTPRINT: ASM001-design:Pkg0402$8; vendor_part_numbers.lcsc: C106208; price: 0.000884058; stock: 91353; mounting: smd; case: 0402; vendor_part_numbers.digi-key: 311-1418-2-ND; x: 0.5; category: capacitor; Datasheet: https://www.lcsc.com/datasheet/lcsc_datasheet_2304140030_YAGEO-CC0402KRX7R9BB472_C106208.pdf
C2 C6 = C338130: manufacturer_aliases: ["Walsin Technology Corporation"]; manufacturer: Walsin Technology Corporation; mpn_aliases: ["0402B222K500CT"]; mpn: 0402B222K500CT; REFERENCE: false; capacitor: true; metadata.applications: General Purpose; metadata.packaging: Tape & Reel (TR); reference_prefix: C; area: 0.5; tolerance: Toleranced(1.98e-009 <= 2.2e-009 <= 2.42e-009); rated-voltage: 50.0; query-properties: ["tolerance" => 0.1 "case" => ["0201" "0603m" "0202" "0606m" "0204" "0510m" "Wide 0402" "0306" "0816m" "Wide 0603" "0402" "1005m" "0505" "1414m" "0508" "1220m" "Wide 0805" "0603" "1608m" "0612" "1632m" "Wide 1206" "0805" "2012m" "1111" "2828m" "1206" "3216m" "1210" "3225m" "1218" "3246m" "Wide 1812" "1225" "3263m" "Wide 2512" "1530" "3876m" "Wide 3015" "1808" "4520m" "1812" "4532m" "1825" "4564m" "1835" "4589" "Wide 3518" "5020m" "2010" "5025m" "2043" "Wide 4320" "2220" "5750m" "2225" "5763m" "2312" "6032m" "2512" "6331m" "2725" "7142m" "2728" "7142m" "Wide 2827" "2816" "2817" "7142m" "2953" "Wide 5929" "3920" "1052m"] "rated-voltage" => 50.0 "capacitance" => 2.2e-009 "type" => "ceramic" "temperature-coefficient.code" => ["X7R" "X5R"] "category" => "capacitor" "mounting" => "smd" "min-stock" => 1 "_sellers" => ["JLCPCB"]]; trust: low; minimum_quantity: 20; cofactr_id: CCV6Z375U8GT; rated-temperature: Toleranced(-55.0 <= 35.0 <= 125.0); capacitance: 2.2e-009; temperature-coefficent: X7R; y: 1.0; type: ceramic; metadata.description: 50V 2.2nF X7R ±10% 0402  Multilayer Ceramic Capacitors MLCC - SMD/SMT ROHS; Maximum Voltage: 50.0V; FOOTPRINT: ASM001-design:Pkg0402$1; vendor_part_numbers.lcsc: C338130; price: 0.000913043; stock: 10095; mounting: smd; case: 0402; vendor_part_numbers.digi-key: 1292-1193-2-ND; x: 0.5; category: capacitor; Datasheet: https://wmsc.lcsc.com/wmsc/upload/file/pdf/v2/lcsc/2304140030_Walsin-Tech-Corp-0402B222K500CT_C338130.pdf
C3 = C106208$2: manufacturer_aliases: ["YAGEO"]; manufacturer: YAGEO; mpn_aliases: ["CC0402KRX7R9BB472"]; mpn: CC0402KRX7R9BB472; REFERENCE: false; capacitor: true; metadata.applications: General Purpose; metadata.packaging: Tape & Reel (TR); reference_prefix: C; area: 0.5; tolerance: Toleranced(4.23e-009 <= 4.7e-009 <= 5.17e-009); rated-voltage: 50.0; query-properties: ["min-rated-voltage" => 0.35595 "capacitance" => 4.7e-009 "tolerance" => 0.1 "type" => "ceramic" "temperature-coefficient.code" => ["X7R" "X5R"] "category" => "capacitor" "case" => ["0402" "0603" "0805" "1210"] "mounting" => "smd" "min-stock" => 1 "_sellers" => ["JLCPCB"]]; trust: low; minimum_quantity: 20; cofactr_id: CC7G7J78HHCN; rated-temperature: Toleranced(-55.0 <= 35.0 <= 125.0); capacitance: 4.7e-009; temperature-coefficent: X7R; y: 1.0; type: ceramic; metadata.description: 50V 4.7nF X7R ±10% 0402  Multilayer Ceramic Capacitors MLCC - SMD/SMT ROHS; Maximum Voltage: 50.0V; FOOTPRINT: ASM001-design:Pkg0402$15; vendor_part_numbers.lcsc: C106208; price: 0.000884058; stock: 91353; mounting: smd; case: 0402; vendor_part_numbers.digi-key: 311-1418-2-ND; x: 0.5; category: capacitor; Datasheet: https://www.lcsc.com/datasheet/lcsc_datasheet_2304140030_YAGEO-CC0402KRX7R9BB472_C106208.pdf
C4 = C87997$1: manufacturer_aliases: ["Samsung Electro-Mechanics"]; manufacturer: Samsung Electro-Mechanics; mpn_aliases: ["CL21A226KQQNNNE"]; mpn: CL21A226KQQNNNE; REFERENCE: false; capacitor: true; metadata.applications: General Purpose; metadata.packaging: Tape & Reel (TR); reference_prefix: C; area: 2.4; tolerance: Toleranced(1.98e-005 <= 2.2e-005 <= 2.42e-005); rated-voltage: 6.3; query-properties: ["min-rated-voltage" => 0.35595 "capacitance" => 2.2e-005 "tolerance" => 0.1 "type" => "ceramic" "temperature-coefficient.code" => ["X7R" "X5R"] "category" => "capacitor" "case" => ["0402" "0603" "0805" "1210"] "mounting" => "smd" "min-stock" => 1 "_sellers" => ["JLCPCB"]]; trust: low; minimum_quantity: 5; cofactr_id: CC3ZNPURR0Q3; rated-temperature: Toleranced(-55.0 <= 15.0 <= 85.0); capacitance: 2.2e-005; temperature-coefficent: X5R; x: 1.2; y: 2.0; type: ceramic; metadata.description: 6.3V 22uF X5R ±10% 0805  Multilayer Ceramic Capacitors MLCC - SMD/SMT ROHS; Maximum Voltage: 6.3V; FOOTPRINT: ASM001-design:Pkg0805; vendor_part_numbers.lcsc: C87997; price: 0.024202899; stock: 6100; mounting: smd; case: 0805; vendor_part_numbers.digi-key: 1276-2907-2-ND; category: capacitor; Datasheet: https://www.lcsc.com/datasheet/lcsc_datasheet_2304140030_Samsung-Electro-Mechanics-CL21A226KQQNNNE_C87997.pdf
C5 = C19702$2: manufacturer_aliases: ["Samsung Electro-Mechanics"]; manufacturer: Samsung Electro-Mechanics; mpn_aliases: ["CL10A106KP8NNNC"]; mpn: CL10A106KP8NNNC; REFERENCE: false; capacitor: true; metadata.applications: General Purpose; metadata.packaging: Cut Tape (CT); reference_prefix: C; area: 1.28; tolerance: Toleranced(9.0e-006 <= 1.0e-005 <= 1.1e-005); rated-voltage: 10.0; query-properties: ["min-rated-voltage" => 1.65 "capacitance" => 1.0e-005 "tolerance" => 0.1 "type" => "ceramic" "temperature-coefficient.code" => ["X7R" "X5R"] "category" => "capacitor" "case" => ["0402" "0603" "0805" "1210"] "mounting" => "smd" "min-stock" => 1 "_sellers" => ["JLCPCB"]]; trust: low; minimum_quantity: 20; cofactr_id: XXV72YFXSLXT; rated-temperature: Toleranced(-55.0 <= 15.0 <= 85.0); capacitance: 1.0e-005; temperature-coefficent: X5R; x: 0.8; y: 1.6; type: ceramic; metadata.description: 10V 10uF X5R ±10% 0603  Multilayer Ceramic Capacitors MLCC - SMD/SMT ROHS; Maximum Voltage: 10.0V; FOOTPRINT: ASM001-design:Pkg0603$3; vendor_part_numbers.lcsc: C19702; price: 0.004536232; stock: 5110333; mounting: smd; case: 0603; vendor_part_numbers.digi-key: 1276-1192-1-ND; category: capacitor; Datasheet: https://www.lcsc.com/datasheet/lcsc_datasheet_2304140030_Samsung-Electro-Mechanics-CL10A106KP8NNNC_C19702.pdf
C7-C9 C13 = C76931: manufacturer_aliases: ["Murata Electronics"]; manufacturer: Murata Electronics; mpn_aliases: ["GRM033R60J224KE15D"]; mpn: GRM033R60J224KE15D; REFERENCE: false; capacitor: true; metadata.applications: General Purpose; metadata.packaging: Cut Tape (CT); reference_prefix: C; area: 0.18; tolerance: Toleranced(1.98e-007 <= 2.2e-007 <= 2.42e-007); rated-voltage: 6.3; query-properties: ["case" => ["0201" "0603m" "0202" "0606m" "0204" "0510m" "Wide 0402" "0306" "0816m" "Wide 0603" "0402" "1005m" "0505" "1414m" "0508" "1220m" "Wide 0805" "0603" "1608m" "0612" "1632m" "Wide 1206" "0805" "2012m" "1111" "2828m" "1206" "3216m" "1210" "3225m" "1218" "3246m" "Wide 1812" "1225" "3263m" "Wide 2512" "1530" "3876m" "Wide 3015" "1808" "4520m" "1812" "4532m" "1825" "4564m" "1835" "4589" "Wide 3518" "5020m" "2010" "5025m" "2043" "Wide 4320" "2220" "5750m" "2225" "5763m" "2312" "6032m" "2512" "6331m" "2725" "7142m" "2728" "7142m" "Wide 2827" "2816" "2817" "7142m" "2953" "Wide 5929" "3920" "1052m"] "min-capacitance" => 1.35e-007 "max-capacitance" => 265000.0 "tolerance" => 0.1 "type" => "ceramic" "temperature-coefficient.code" => ["X7R" "X5R"] "min-rated-voltage" => 6.0 "category" => "capacitor" "mounting" => "smd" "min-stock" => 1 "_sellers" => ["JLCPCB"]]; trust: low; minimum_quantity: 20; cofactr_id: CCC4JRK6CIEE; rated-temperature: Toleranced(-55.0 <= 15.0 <= 85.0); capacitance: 2.2e-007; temperature-coefficent: X5R; x: 0.3; y: 0.6; type: ceramic; metadata.description: 6.3V 220nF X5R ±10% 0201  Multilayer Ceramic Capacitors MLCC - SMD/SMT ROHS; Maximum Voltage: 6.3V; FOOTPRINT: ASM001-design:Pkg0201; vendor_part_numbers.lcsc: C76931; price: 0.002028986; stock: 8578; mounting: smd; case: 0201; vendor_part_numbers.digi-key: 490-10406-1-ND; category: capacitor; Datasheet: https://wmsc.lcsc.com/wmsc/upload/file/pdf/v2/lcsc/1811081531_Murata-Electronics-GRM033R60J224KE15D_C76931.pdf
C10 = C106208: manufacturer_aliases: ["YAGEO"]; manufacturer: YAGEO; mpn_aliases: ["CC0402KRX7R9BB472"]; mpn: CC0402KRX7R9BB472; REFERENCE: false; capacitor: true; metadata.applications: General Purpose; metadata.packaging: Tape & Reel (TR); reference_prefix: C; area: 0.5; tolerance: Toleranced(4.23e-009 <= 4.7e-009 <= 5.17e-009); rated-voltage: 50.0; query-properties: ["min-rated-voltage" => 0.5985 "capacitance" => 4.7e-009 "tolerance" => 0.1 "type" => "ceramic" "temperature-coefficient.code" => ["X7R" "X5R"] "category" => "capacitor" "case" => ["0402" "0603" "0805" "1210"] "mounting" => "smd" "min-stock" => 1 "_sellers" => ["JLCPCB"]]; trust: low; minimum_quantity: 20; cofactr_id: CC7G7J78HHCN; rated-temperature: Toleranced(-55.0 <= 35.0 <= 125.0); capacitance: 4.7e-009; temperature-coefficent: X7R; y: 1.0; type: ceramic; metadata.description: 50V 4.7nF X7R ±10% 0402  Multilayer Ceramic Capacitors MLCC - SMD/SMT ROHS; Maximum Voltage: 50.0V; FOOTPRINT: ASM001-design:Pkg0402$11; vendor_part_numbers.lcsc: C106208; price: 0.000884058; stock: 91353; mounting: smd; case: 0402; vendor_part_numbers.digi-key: 311-1418-2-ND; x: 0.5; category: capacitor; Datasheet: https://www.lcsc.com/datasheet/lcsc_datasheet_2304140030_YAGEO-CC0402KRX7R9BB472_C106208.pdf
C11 = C87997: manufacturer_aliases: ["Samsung Electro-Mechanics"]; manufacturer: Samsung Electro-Mechanics; mpn_aliases: ["CL21A226KQQNNNE"]; mpn: CL21A226KQQNNNE; REFERENCE: false; capacitor: true; metadata.applications: General Purpose; metadata.packaging: Tape & Reel (TR); reference_prefix: C; area: 2.4; tolerance: Toleranced(1.98e-005 <= 2.2e-005 <= 2.42e-005); rated-voltage: 6.3; query-properties: ["min-rated-voltage" => 0.5985 "capacitance" => 2.2e-005 "tolerance" => 0.1 "type" => "ceramic" "temperature-coefficient.code" => ["X7R" "X5R"] "category" => "capacitor" "case" => ["0402" "0603" "0805" "1210"] "mounting" => "smd" "min-stock" => 1 "_sellers" => ["JLCPCB"]]; trust: low; minimum_quantity: 5; cofactr_id: CC3ZNPURR0Q3; rated-temperature: Toleranced(-55.0 <= 15.0 <= 85.0); capacitance: 2.2e-005; temperature-coefficent: X5R; x: 1.2; y: 2.0; type: ceramic; metadata.description: 6.3V 22uF X5R ±10% 0805  Multilayer Ceramic Capacitors MLCC - SMD/SMT ROHS; Maximum Voltage: 6.3V; FOOTPRINT: ASM001-design:Pkg0805$2; vendor_part_numbers.lcsc: C87997; price: 0.024202899; stock: 6100; mounting: smd; case: 0805; vendor_part_numbers.digi-key: 1276-2907-2-ND; category: capacitor; Datasheet: https://www.lcsc.com/datasheet/lcsc_datasheet_2304140030_Samsung-Electro-Mechanics-CL21A226KQQNNNE_C87997.pdf
C12 = C19702$1: manufacturer_aliases: ["Samsung Electro-Mechanics"]; manufacturer: Samsung Electro-Mechanics; mpn_aliases: ["CL10A106KP8NNNC"]; mpn: CL10A106KP8NNNC; REFERENCE: false; capacitor: true; metadata.applications: General Purpose; metadata.packaging: Cut Tape (CT); reference_prefix: C; area: 1.28; tolerance: Toleranced(9.0e-006 <= 1.0e-005 <= 1.1e-005); rated-voltage: 10.0; query-properties: ["min-rated-voltage" => 1.65 "capacitance" => 1.0e-005 "tolerance" => 0.1 "type" => "ceramic" "temperature-coefficient.code" => ["X7R" "X5R"] "category" => "capacitor" "case" => ["0402" "0603" "0805" "1210"] "mounting" => "smd" "min-stock" => 1 "_sellers" => ["JLCPCB"]]; trust: low; minimum_quantity: 20; cofactr_id: XXV72YFXSLXT; rated-temperature: Toleranced(-55.0 <= 15.0 <= 85.0); capacitance: 1.0e-005; temperature-coefficent: X5R; x: 0.8; y: 1.6; type: ceramic; metadata.description: 10V 10uF X5R ±10% 0603  Multilayer Ceramic Capacitors MLCC - SMD/SMT ROHS; Maximum Voltage: 10.0V; FOOTPRINT: ASM001-design:Pkg0603$2; vendor_part_numbers.lcsc: C19702; price: 0.004536232; stock: 5110333; mounting: smd; case: 0603; vendor_part_numbers.digi-key: 1276-1192-1-ND; category: capacitor; Datasheet: https://www.lcsc.com/datasheet/lcsc_datasheet_2304140030_Samsung-Electro-Mechanics-CL10A106KP8NNNC_C19702.pdf
C14-C16 C20 = C85926: manufacturer_aliases: ["Murata Electronics"]; manufacturer: Murata Electronics; mpn_aliases: ["GRM033R60J474KE90D"]; mpn: GRM033R60J474KE90D; REFERENCE: false; capacitor: true; metadata.applications: General Purpose; metadata.packaging: Cut Tape (CT); reference_prefix: C; area: 0.18; tolerance: Toleranced(4.23e-007 <= 4.7e-007 <= 5.17e-007); rated-voltage: 6.3; query-properties: ["case" => ["0201" "0603m" "0202" "0606m" "0204" "0510m" "Wide 0402" "0306" "0816m" "Wide 0603" "0402" "1005m" "0505" "1414m" "0508" "1220m" "Wide 0805" "0603" "1608m" "0612" "1632m" "Wide 1206" "0805" "2012m" "1111" "2828m" "1206" "3216m" "1210" "3225m" "1218" "3246m" "Wide 1812" "1225" "3263m" "Wide 2512" "1530" "3876m" "Wide 3015" "1808" "4520m" "1812" "4532m" "1825" "4564m" "1835" "4589" "Wide 3518" "5020m" "2010" "5025m" "2043" "Wide 4320" "2220" "5750m" "2225" "5763m" "2312" "6032m" "2512" "6331m" "2725" "7142m" "2728" "7142m" "Wide 2827" "2816" "2817" "7142m" "2953" "Wide 5929" "3920" "1052m"] "min-capacitance" => 3.0e-007 "max-capacitance" => 363000.0 "tolerance" => 0.1 "type" => "ceramic" "temperature-coefficient.code" => ["X7R" "X5R"] "min-rated-voltage" => 6.0 "category" => "capacitor" "mounting" => "smd" "min-stock" => 1 "_sellers" => ["JLCPCB"]]; trust: low; minimum_quantity: 20; cofactr_id: CCIA9C79QNHV; rated-temperature: Toleranced(-55.0 <= 15.0 <= 85.0); capacitance: 4.7e-007; temperature-coefficent: X5R; x: 0.3; y: 0.6; type: ceramic; metadata.description: 6.3V 470nF X5R ±10% 0201  Multilayer Ceramic Capacitors MLCC - SMD/SMT ROHS; Maximum Voltage: 6.3V; FOOTPRINT: ASM001-design:Pkg0201$3; vendor_part_numbers.lcsc: C85926; price: 0.002376812; stock: 47487; mounting: smd; case: 0201; vendor_part_numbers.digi-key: 490-10409-1-ND; category: capacitor; Datasheet: https://wmsc.lcsc.com/wmsc/upload/file/pdf/v2/lcsc/2212052030_Murata-Electronics-GRM033R60J474KE90D_C85926.pdf
C17 = C106208$3: manufacturer_aliases: ["YAGEO"]; manufacturer: YAGEO; mpn_aliases: ["CC0402KRX7R9BB472"]; mpn: CC0402KRX7R9BB472; REFERENCE: false; capacitor: true; metadata.applications: General Purpose; metadata.packaging: Tape & Reel (TR); reference_prefix: C; area: 0.5; tolerance: Toleranced(4.23e-009 <= 4.7e-009 <= 5.17e-009); rated-voltage: 50.0; query-properties: ["min-rated-voltage" => 1.0197 "capacitance" => 4.7e-009 "tolerance" => 0.1 "type" => "ceramic" "temperature-coefficient.code" => ["X7R" "X5R"] "category" => "capacitor" "case" => ["0402" "0603" "0805" "1210"] "mounting" => "smd" "min-stock" => 1 "_sellers" => ["JLCPCB"]]; trust: low; minimum_quantity: 20; cofactr_id: CC7G7J78HHCN; rated-temperature: Toleranced(-55.0 <= 35.0 <= 125.0); capacitance: 4.7e-009; temperature-coefficent: X7R; y: 1.0; type: ceramic; metadata.description: 50V 4.7nF X7R ±10% 0402  Multilayer Ceramic Capacitors MLCC - SMD/SMT ROHS; Maximum Voltage: 50.0V; FOOTPRINT: ASM001-design:Pkg0402$4; vendor_part_numbers.lcsc: C106208; price: 0.000884058; stock: 91353; mounting: smd; case: 0402; vendor_part_numbers.digi-key: 311-1418-2-ND; x: 0.5; category: capacitor; Datasheet: https://www.lcsc.com/datasheet/lcsc_datasheet_2304140030_YAGEO-CC0402KRX7R9BB472_C106208.pdf
C18 = C87997$2: manufacturer_aliases: ["Samsung Electro-Mechanics"]; manufacturer: Samsung Electro-Mechanics; mpn_aliases: ["CL21A226KQQNNNE"]; mpn: CL21A226KQQNNNE; REFERENCE: false; capacitor: true; metadata.applications: General Purpose; metadata.packaging: Tape & Reel (TR); reference_prefix: C; area: 2.4; tolerance: Toleranced(1.98e-005 <= 2.2e-005 <= 2.42e-005); rated-voltage: 6.3; query-properties: ["min-rated-voltage" => 1.0197 "capacitance" => 2.2e-005 "tolerance" => 0.1 "type" => "ceramic" "temperature-coefficient.code" => ["X7R" "X5R"] "category" => "capacitor" "case" => ["0402" "0603" "0805" "1210"] "mounting" => "smd" "min-stock" => 1 "_sellers" => ["JLCPCB"]]; trust: low; minimum_quantity: 5; cofactr_id: CC3ZNPURR0Q3; rated-temperature: Toleranced(-55.0 <= 15.0 <= 85.0); capacitance: 2.2e-005; temperature-coefficent: X5R; x: 1.2; y: 2.0; type: ceramic; metadata.description: 6.3V 22uF X5R ±10% 0805  Multilayer Ceramic Capacitors MLCC - SMD/SMT ROHS; Maximum Voltage: 6.3V; FOOTPRINT: ASM001-design:Pkg0805$1; vendor_part_numbers.lcsc: C87997; price: 0.024202899; stock: 6100; mounting: smd; case: 0805; vendor_part_numbers.digi-key: 1276-2907-2-ND; category: capacitor; Datasheet: https://www.lcsc.com/datasheet/lcsc_datasheet_2304140030_Samsung-Electro-Mechanics-CL21A226KQQNNNE_C87997.pdf
C19 = C19702: manufacturer_aliases: ["Samsung Electro-Mechanics"]; manufacturer: Samsung Electro-Mechanics; mpn_aliases: ["CL10A106KP8NNNC"]; mpn: CL10A106KP8NNNC; REFERENCE: false; capacitor: true; metadata.applications: General Purpose; metadata.packaging: Cut Tape (CT); reference_prefix: C; area: 1.28; tolerance: Toleranced(9.0e-006 <= 1.0e-005 <= 1.1e-005); rated-voltage: 10.0; query-properties: ["min-rated-voltage" => 1.65 "capacitance" => 1.0e-005 "tolerance" => 0.1 "type" => "ceramic" "temperature-coefficient.code" => ["X7R" "X5R"] "category" => "capacitor" "case" => ["0402" "0603" "0805" "1210"] "mounting" => "smd" "min-stock" => 1 "_sellers" => ["JLCPCB"]]; trust: low; minimum_quantity: 20; cofactr_id: XXV72YFXSLXT; rated-temperature: Toleranced(-55.0 <= 15.0 <= 85.0); capacitance: 1.0e-005; temperature-coefficent: X5R; x: 0.8; y: 1.6; type: ceramic; metadata.description: 10V 10uF X5R ±10% 0603  Multilayer Ceramic Capacitors MLCC - SMD/SMT ROHS; Maximum Voltage: 10.0V; FOOTPRINT: ASM001-design:Pkg0603$1; vendor_part_numbers.lcsc: C19702; price: 0.004536232; stock: 5110333; mounting: smd; case: 0603; vendor_part_numbers.digi-key: 1276-1192-1-ND; category: capacitor; Datasheet: https://www.lcsc.com/datasheet/lcsc_datasheet_2304140030_Samsung-Electro-Mechanics-CL10A106KP8NNNC_C19702.pdf
JITX1 = JITX: REFERENCE: false; FOOTPRINT: ASM001-design:JITX_SM_LP; MPN: non-BOM; Manufacturer: non-BOM
L1-L3 = component$3: MPN: XFL3012-102MEC; Manufacturer: Coilcraft; REFERENCE: false; derate-temp: 65.0; rated-current: Toleranced(2.3 <= 2.3 <= 2.3); inductance: Toleranced(8.0e-007 <= 1.0e-006 <= 1.2e-006); DC-resistance: Toleranced(0.039 <= 0.039 <= 0.046); self-resonant-frequency: 115000000.0; derate-current: Toleranced(2.6 <= 2.6 <= 2.6); Tolerance: 0.2%; Maximum Current: 2.3A; FOOTPRINT: ASM001-design:MOLDED; Datasheet: https://www.coilcraft.com/getmedia/f76a3c9b-4fff-4397-8028-ef8e043eb200/xfl3012.pdf
R1 = my_resistor$4: mpn_aliases: ["SC0402F0000I2ANRH"]; mpn: SC0402F0000I2ANRH; manufacturer_aliases: ["Sunway"]; manufacturer: Sunway; REFERENCE: false; reference_prefix: R; resistor: true; area: 0.5; tolerance: Toleranced(0.0 <= 0.0 <= 0.0); query-properties: ["tolerance" => 0.01 "resistance" => 0.0 "category" => "resistor" "min-stock" => 1 "_sellers" => ["JLCPCB"]]; trust: low; y: 1.0; minimum_quantity: 20; rated-power: 0.0625; metadata.description: 62.5mW ±300ppm/℃ ±1% 0Ω 0402  Chip Resistor - Surface Mount ROHS; Maximum Power: 0.0625W; FOOTPRINT: ASM001-design:Pkg0402$16; vendor_part_numbers.lcsc: C3152056; mounting: smd; price: 0.000362319; case: 0402; stock: 100806; x: 0.5; category: resistor; Resistance: 0R; Datasheet: https://datasheet.lcsc.com/lcsc/2207281800_Sunway-SC0402F0000I2ANRH_C3152056.pdf
R2 = C364360: manufacturer_aliases: ["YAGEO"]; manufacturer: YAGEO; mpn_aliases: ["RC0402FR-076K49L"]; mpn: RC0402FR-076K49L; REFERENCE: false; metadata.number-of-terminations: 2.0; TCR: [-0.0001 0.0001]; metadata.packaging: Tape & Reel (TR); reference_prefix: R; resistor: true; area: 0.5; tolerance: Toleranced(6425.1 <= 6490.0 <= 6554.9); query-properties: ["tolerance" => 0.01 "_exist" => ["tcr.pos" "tcr.neg"] "resistance" => 6490.0 "category" => "resistor" "case" => ["0402" "0603" "0805" "1210"] "mounting" => "smd" "min-stock" => 1 "_sellers" => ["JLCPCB"]]; trust: low; minimum_quantity: 20; metadata.features: Moisture Resistant; cofactr_id: RCKZPCG5OWB6; rated-temperature: Toleranced(-55.0 <= 50.0 <= 155.0); y: 1.0; resistance: 6490.0; rated-power: 0.063; metadata.description: 62.5mW Thick Film Resistors ±100ppm/℃ ±1% 6.49kΩ 0402  Chip Resistor - Surface Mount ROHS; Maximum Power: 0.063W; FOOTPRINT: ASM001-design:Pkg0402$14; vendor_part_numbers.lcsc: C364360; price: 0.000521739; stock: 658; mounting: smd; composition: thick-film; case: 0402; metadata.supplier-device-package: 402; vendor_part_numbers.digi-key: 311-6.49KLRTR-ND; x: 0.5; type: chip; category: resistor; Datasheet: https://wmsc.lcsc.com/wmsc/upload/file/pdf/v2/lcsc/2304140030_YAGEO-RC0402FR-076K49L_C364360.pdf
R3 = my_resistor$9: mpn_aliases: ["FRC0402F4301TS"]; mpn: FRC0402F4301TS; manufacturer_aliases: ["FOJAN"]; manufacturer: FOJAN; REFERENCE: false; reference_prefix: R; resistor: true; area: 0.5; tolerance: Toleranced(4257.0 <= 4300.0 <= 4343.0); query-properties: ["tolerance" => 0.01 "_exist" => ["tcr.pos" "tcr.neg"] "resistance" => 4300.0 "category" => "resistor" "case" => ["0402" "0603" "0805" "1210"] "mounting" => "smd" "min-stock" => 1 "_sellers" => ["JLCPCB"]]; trust: low; y: 1.0; resistance: 4300.0; minimum_quantity: 20; rated-power: 0.0625; metadata.description: 62.5mW Thick Film Resistors ±100ppm/℃ ±1% 4.3kΩ 0402  Chip Resistor - Surface Mount ROHS; Maximum Power: 0.0625W; FOOTPRINT: ASM001-design:Pkg0402; vendor_part_numbers.lcsc: C2930008; mounting: smd; price: 0.000463768; case: 0402; stock: 1274; x: 0.5; category: resistor; Datasheet: https://wmsc.lcsc.com/wmsc/upload/file/pdf/v2/lcsc/2308241009_FOJAN-FRC0402F4301TS_C2930008.pdf
R4 = my_resistor$1: mpn_aliases: ["SC0402F0000I2ANRH"]; mpn: SC0402F0000I2ANRH; manufacturer_aliases: ["Sunway"]; manufacturer: Sunway; REFERENCE: false; reference_prefix: R; resistor: true; area: 0.5; tolerance: Toleranced(0.0 <= 0.0 <= 0.0); query-properties: ["tolerance" => 0.01 "resistance" => 0.0 "category" => "resistor" "min-stock" => 1 "_sellers" => ["JLCPCB"]]; trust: low; y: 1.0; minimum_quantity: 20; rated-power: 0.0625; metadata.description: 62.5mW ±300ppm/℃ ±1% 0Ω 0402  Chip Resistor - Surface Mount ROHS; Maximum Power: 0.0625W; FOOTPRINT: ASM001-design:Pkg0402$6; vendor_part_numbers.lcsc: C3152056; mounting: smd; price: 0.000362319; case: 0402; stock: 100806; x: 0.5; category: resistor; Resistance: 0R; Datasheet: https://datasheet.lcsc.com/lcsc/2207281800_Sunway-SC0402F0000I2ANRH_C3152056.pdf
R5 = C334647: manufacturer_aliases: ["Walsin Technology Corporation"]; manufacturer: Walsin Technology Corporation; mpn_aliases: ["WR04X1332FTL"]; mpn: WR04X1332FTL; REFERENCE: false; metadata.number-of-terminations: 2.0; TCR: [-0.0001 0.0001]; metadata.packaging: Tape & Reel (TR); reference_prefix: R; resistor: true; area: 0.5; tolerance: Toleranced(13167.0 <= 13300.0 <= 13433.0); query-properties: ["tolerance" => 0.01 "_exist" => ["tcr.pos" "tcr.neg"] "resistance" => 13300.0 "category" => "resistor" "case" => ["0402" "0603" "0805" "1210"] "mounting" => "smd" "min-stock" => 1 "_sellers" => ["JLCPCB"]]; trust: low; minimum_quantity: 20; cofactr_id: RCAMEG8S2B67; rated-temperature: Toleranced(-55.0 <= 50.0 <= 155.0); y: 1.0; resistance: 13300.0; rated-power: 0.063; metadata.description: 62.5mW Thick Film Resistors ±100ppm/℃ ±1% 13.3kΩ 0402  Chip Resistor - Surface Mount ROHS; Maximum Power: 0.063W; FOOTPRINT: ASM001-design:Pkg0402$9; vendor_part_numbers.lcsc: C334647; price: 0.000550725; stock: 1593; mounting: smd; composition: thick-film; case: 0402; metadata.supplier-device-package: 402; vendor_part_numbers.digi-key: 1292-WR04X1332FTLTR-ND; x: 0.5; type: chip; category: resistor; Datasheet: https://wmsc.lcsc.com/wmsc/upload/file/pdf/v2/lcsc/2304140030_Walsin-Tech-Corp-WR04X1332FTL_C334647.pdf
R6 = C327340: manufacturer_aliases: ["YAGEO"]; manufacturer: YAGEO; mpn_aliases: ["RC0402FR-074K12L"]; mpn: RC0402FR-074K12L; REFERENCE: false; metadata.number-of-terminations: 2.0; TCR: [-0.0001 0.0001]; metadata.packaging: Tape & Reel (TR); reference_prefix: R; resistor: true; area: 0.5; tolerance: Toleranced(4078.8 <= 4120.0 <= 4161.2); query-properties: ["tolerance" => 0.01 "_exist" => ["tcr.pos" "tcr.neg"] "resistance" => 4120.0 "category" => "resistor" "case" => ["0402" "0603" "0805" "1210"] "mounting" => "smd" "min-stock" => 1 "_sellers" => ["JLCPCB"]]; trust: low; minimum_quantity: 20; metadata.features: Moisture Resistant; cofactr_id: XX5JAF8ZBICW; rated-temperature: Toleranced(-55.0 <= 50.0 <= 155.0); y: 1.0; resistance: 4120.0; rated-power: 0.063; metadata.description: 62.5mW Thick Film Resistors ±100ppm/℃ ±1% 4.12kΩ 0402  Chip Resistor - Surface Mount ROHS; Maximum Power: 0.063W; FOOTPRINT: ASM001-design:Pkg0402$13; vendor_part_numbers.lcsc: C327340; price: 0.000521739; stock: 272; mounting: smd; composition: thick-film; case: 0402; metadata.supplier-device-package: 402; vendor_part_numbers.digi-key: YAG3171TR-ND; x: 0.5; type: chip; category: resistor; Datasheet: https://wmsc.lcsc.com/wmsc/upload/file/pdf/v2/lcsc/1811011622_YAGEO-RC0402FR-074K12L_C327340.pdf
R7 R17 R27 R29-R33 = my_resistor: mpn_aliases: ["SC0201F2003G1BNRH"]; mpn: SC0201F2003G1BNRH; manufacturer_aliases: ["Sunway"]; manufacturer: Sunway; REFERENCE: false; reference_prefix: R; resistor: true; area: 0.18; tolerance: Toleranced(198000.0 <= 200000.0 <= 202000.0); query-properties: ["case" => ["0201" "0603m" "0202" "0606m" "0204" "0510m" "Wide 0402" "0306" "0816m" "Wide 0603" "0402" "1005m" "0505" "1414m" "0508" "1220m" "Wide 0805" "0603" "1608m" "0612" "1632m" "Wide 1206" "0805" "2012m" "1111" "2828m" "1206" "3216m" "1210" "3225m" "1218" "3246m" "Wide 1812" "1225" "3263m" "Wide 2512" "1530" "3876m" "Wide 3015" "1808" "4520m" "1812" "4532m" "1825" "4564m" "1835" "4589" "Wide 3518" "5020m" "2010" "5025m" "2043" "Wide 4320" "2220" "5750m" "2225" "5763m" "2312" "6032m" "2512" "6331m" "2725" "7142m" "2728" "7142m" "Wide 2827" "2816" "2817" "7142m" "2953" "Wide 5929" "3920" "1052m"] "min-resistance" => 200000.0 "max-resistance" => 242000.0 "tolerance" => 0.01 "category" => "resistor" "mounting" => "smd" "min-stock" => 1 "_sellers" => ["JLCPCB"]]; x: 0.3; trust: low; y: 0.6; resistance: 200000.0; minimum_quantity: 20; rated-power: 0.05; metadata.description: 50mW ±1% ±200ppm/℃ 200kΩ 0201  Chip Resistor - Surface Mount ROHS; Maximum Power: 0.05W; FOOTPRINT: ASM001-design:Pkg0201$1; vendor_part_numbers.lcsc: C3152021; mounting: smd; price: 0.000492754; case: 0201; stock: 7233; category: resistor; Datasheet: https://datasheet.lcsc.com/lcsc/2207281830_Sunway-SC0201F2003G1BNRH_C3152021.pdf
R8 = my_resistor$3: manufacturer_aliases: ["YAGEO"]; manufacturer: YAGEO; mpn_aliases: ["RT0603BRD0726K1L"]; mpn: RT0603BRD0726K1L; REFERENCE: false; metadata.number-of-terminations: 2.0; TCR: [-2.5e-005 2.5e-005]; metadata.packaging: Cut Tape (CT); reference_prefix: R; resistor: true; area: 1.28; tolerance: Toleranced(26073.9 <= 26100.0 <= 26126.1); query-properties: ["tolerance" => 0.001 "_exist" => ["tcr.pos" "tcr.neg"] "resistance" => 26100.0 "category" => "resistor" "case" => ["0402" "0603" "0805" "1210"] "mounting" => "smd" "min-stock" => 1 "_sellers" => ["JLCPCB"]]; trust: low; minimum_quantity: 20; cofactr_id: RCENZ0MSUF8I; rated-temperature: Toleranced(-55.0 <= 50.0 <= 155.0); x: 0.8; y: 1.6; resistance: 26100.0; z: 0.55; rated-power: 0.1; metadata.description: 100mW Thin Film Resistor ±25ppm/℃ ±0.1% 26.1kΩ 0603  Chip Resistor - Surface Mount ROHS; Maximum Power: 0.1W; FOOTPRINT: ASM001-design:Pkg0603; vendor_part_numbers.lcsc: C728586; price: 0.020869565; stock: 2; mounting: smd; composition: thin-film; case: 0603; metadata.supplier-device-package: 603; vendor_part_numbers.digi-key: YAG1603CT-ND; type: chip; category: resistor; Datasheet: https://wmsc.lcsc.com/wmsc/upload/file/pdf/v2/lcsc/2304140030_YAGEO-RT0603BRD0726K1L_C728586.pdf
R9 = my_resistor$6: manufacturer_aliases: ["YAGEO"]; manufacturer: YAGEO; mpn_aliases: ["RT0402BRD074K12L"]; mpn: RT0402BRD074K12L; REFERENCE: false; metadata.number-of-terminations: 2.0; TCR: [-2.5e-005 2.5e-005]; metadata.packaging: Tape & Reel (TR); reference_prefix: R; resistor: true; area: 0.5; tolerance: Toleranced(4115.88 <= 4120.0 <= 4124.12); query-properties: ["tolerance" => 0.001 "_exist" => ["tcr.pos" "tcr.neg"] "resistance" => 4120.0 "category" => "resistor" "case" => ["0402" "0603" "0805" "1210"] "mounting" => "smd" "min-stock" => 1 "_sellers" => ["JLCPCB"]]; trust: low; minimum_quantity: 20; cofactr_id: RCOMYQH3LXUN; rated-temperature: Toleranced(-55.0 <= 50.0 <= 155.0); y: 1.0; resistance: 4120.0; z: 0.35; rated-power: 0.063; metadata.description: 62.5mW Thin Film Resistor ±25ppm/℃ ±0.1% 4.12kΩ 0402  Chip Resistor - Surface Mount ROHS; Maximum Power: 0.063W; FOOTPRINT: ASM001-design:Pkg0402$7; vendor_part_numbers.lcsc: C852812; price: 0.016086957; stock: 75; mounting: smd; composition: thin-film; case: 0402; metadata.supplier-device-package: 402; vendor_part_numbers.digi-key: YAG4272TR-ND; x: 0.5; type: chip; category: resistor; Datasheet: https://wmsc.lcsc.com/wmsc/upload/file/pdf/v2/lcsc/2204130915_YAGEO-RT0402BRD074K12L_C852812.pdf
R26 = my_resistor$5: mpn_aliases: ["SC0402F0000I2ANRH"]; mpn: SC0402F0000I2ANRH; manufacturer_aliases: ["Sunway"]; manufacturer: Sunway; REFERENCE: false; reference_prefix: R; resistor: true; area: 0.5; tolerance: Toleranced(0.0 <= 0.0 <= 0.0); query-properties: ["tolerance" => 0.01 "resistance" => 0.0 "category" => "resistor" "min-stock" => 1 "_sellers" => ["JLCPCB"]]; trust: low; y: 1.0; minimum_quantity: 20; rated-power: 0.0625; metadata.description: 62.5mW ±300ppm/℃ ±1% 0Ω 0402  Chip Resistor - Surface Mount ROHS; Maximum Power: 0.0625W; FOOTPRINT: ASM001-design:Pkg0402$12; vendor_part_numbers.lcsc: C3152056; mounting: smd; price: 0.000362319; case: 0402; stock: 100806; x: 0.5; category: resistor; Resistance: 0R; Datasheet: https://datasheet.lcsc.com/lcsc/2207281800_Sunway-SC0402F0000I2ANRH_C3152056.pdf
R28 = my_resistor$2: mpn_aliases: ["SC0402F0000I2ANRH"]; mpn: SC0402F0000I2ANRH; manufacturer_aliases: ["Sunway"]; manufacturer: Sunway; REFERENCE: false; reference_prefix: R; resistor: true; area: 0.5; tolerance: Toleranced(0.0 <= 0.0 <= 0.0); query-properties: ["resistance" => 0.0 "tolerance" => 0.01 "category" => "resistor" "case" => ["0402" "0603" "0805" "1210"] "mounting" => "smd" "min-stock" => 1 "_sellers" => ["JLCPCB"]]; trust: low; y: 1.0; minimum_quantity: 20; rated-power: 0.0625; metadata.description: 62.5mW ±300ppm/℃ ±1% 0Ω 0402  Chip Resistor - Surface Mount ROHS; Maximum Power: 0.0625W; FOOTPRINT: ASM001-design:Pkg0402$3; vendor_part_numbers.lcsc: C3152056; mounting: smd; price: 0.000362319; case: 0402; stock: 100806; x: 0.5; category: resistor; Resistance: 0R; Datasheet: https://datasheet.lcsc.com/lcsc/2207281800_Sunway-SC0402F0000I2ANRH_C3152056.pdf
TXT1 = ASM2464PDX_4x_M_2_board___Version_0_2_2025_02_07: Manufacturer: non-BOM; REFERENCE: false; FOOTPRINT: ASM001-design:TEXT_LP; rated-temperature: false; MPN: ASM2464PDX 4x M.2 board | Version 0.2 2025-02-07
U1-U3 = component$1: Manufacturer: Texas Instruments; REFERENCE: false; Vin-MIN: 2.3; Vin-MAX: 6.0; R-Discharge: Toleranced(1000.0 <= 1000.0 <= 1000.0); I-LIM: Toleranced(1.6 <= 2.8 <= 4.0); V-REF: Toleranced(0.438 <= 0.45 <= 0.462); Vout-MIN: 0.5; Vout-MAX: 4.0; I-REF: Toleranced(1.0e-008 <= 1.0e-008 <= 1.0e-007); FOOTPRINT: ASM001-design:SON50P200X200_9N; adjustable: false; MPN: TPS62082DSG; Datasheet: https://www.ti.com/lit/ds/symlink/tps62080.pdf
U8 = device: Manufacturer: Texas Instruments; REFERENCE: false; num-single-chs: 4; num-dp-chs: 2; FOOTPRINT: ASM001-design:USON_10; MPN: ESD224DQAR